# Altium project radxa_cm3i_io_board_v1.4.PrjPcb (part 2 of 4)

## Sheet 09.SchDoc
size 297 x 209 mm
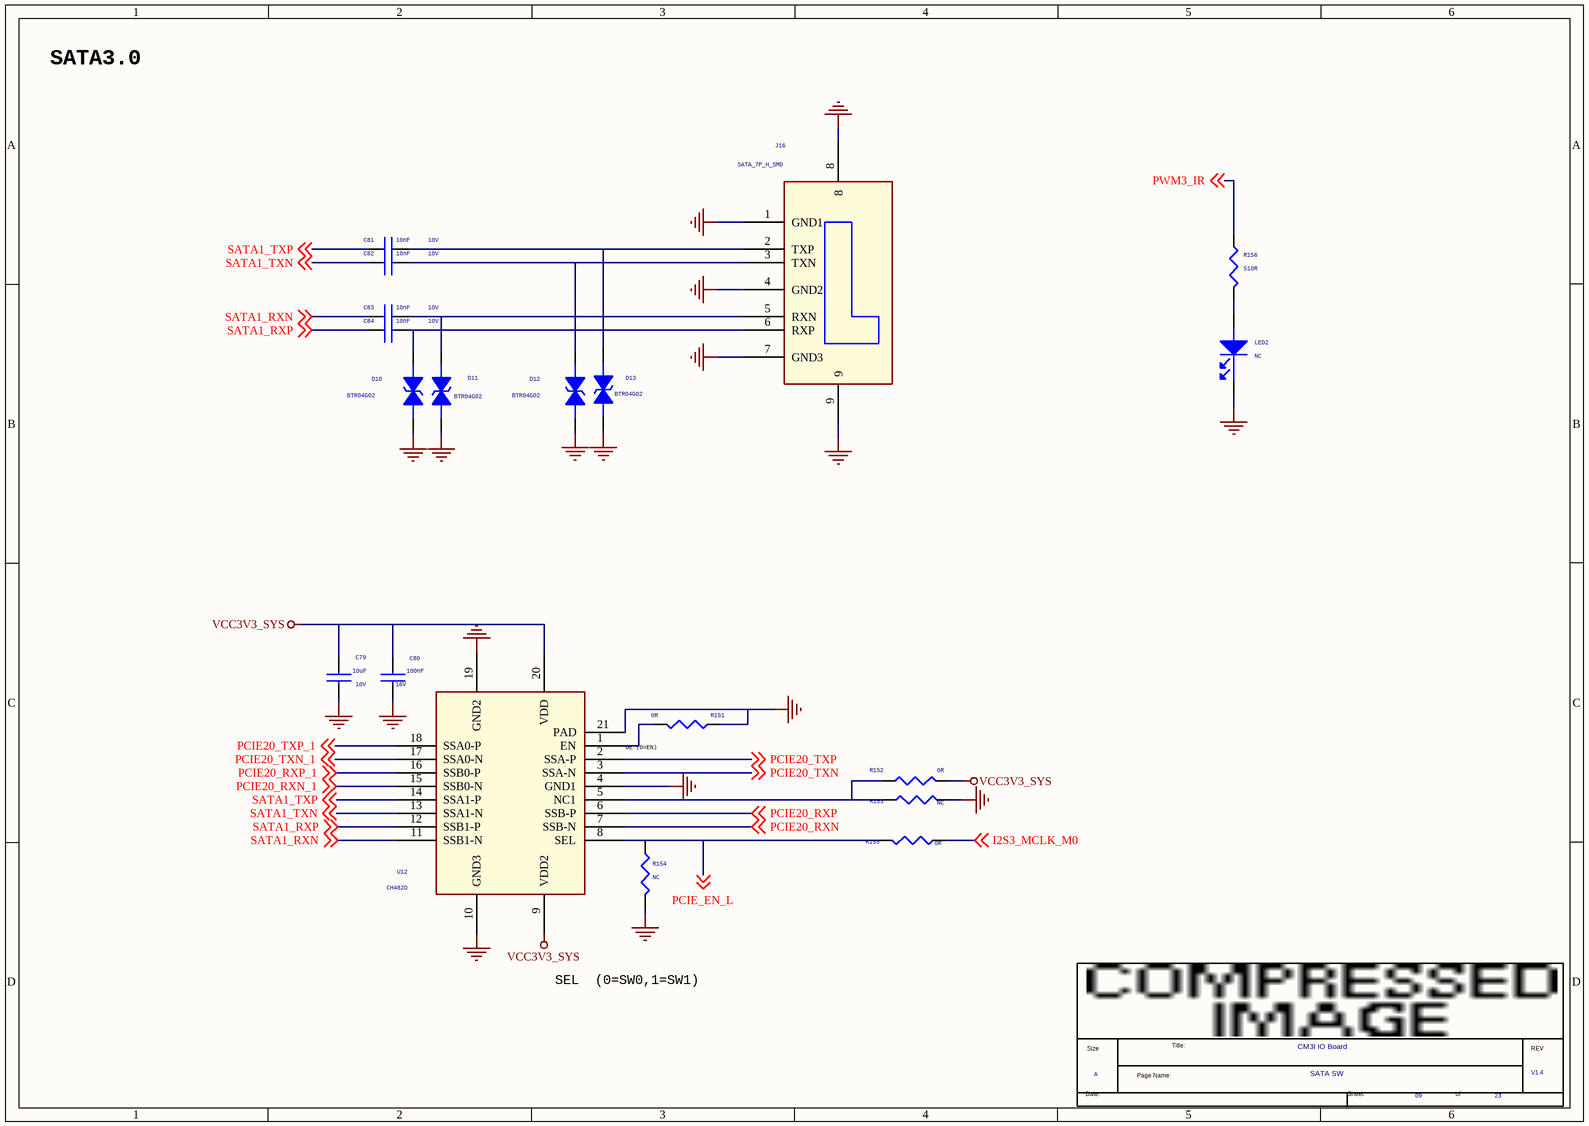
[diagram p7: 09.SchDoc]

### Parts
(Parts that share a designator on the sheet are numbered #1, #2 ... from top to bottom, then left to right.)
*#8  Page Count: 23  Page Number: 09  Page Size: A  Title: CM3I IO Board  RevCode: V1.4  Doc: SATA SW  (hidden comment: radxa_1010)  (graphical)
C79  10uF  Voltage: 10V  [C0603]
C80  100nF  Voltage: 16V  [C0402]
C81  10nF  Voltage: 10V  [C0402]
C82  10nF  Voltage: 10V  [C0402]
C83  10nF  Voltage: 10V  [C0402]
C84  10nF  Voltage: 10V  [C0402]
D10  BTR04G02  [ESD0402_1xD5]
D11  BTR04G02  [ESD0402_1xD5]
D12  BTR04G02  [ESD0402_1xD5]
D13  BTR04G02  [ESD0402_1xD5]
J16  SATA_7P_H_SMD  [SMD_SATA_7P_50_180]
LED2  NC  [LED0603]
R151  0R  [R0402]
R152  0R  [R0402]
R153  NC  [R0402]
R154  NC  [R0402]
R155  0R  [R0402]
R156  510R  [R0402]
U12  CH482D  [CH482X]

### Nets
GND: C79.2 C80.2 D10.1 D11.1 D12.1 D13.1 J16.1(GND1) J16.4(GND2) J16.7(GND3) J16.8 J16.9 LED2.2(CATHODE) R151.1 R153.1 R154.2 U12.4(GND1) U12.10(GND3) U12.19(GND2) U12.21(PAD)
VCC3V3_SYS: C79.1 C80.1 R152.1 U12.9(VDD2) U12.20(VDD)
I2S3_MCLK_M0: R155.2 ; off-sheet I2S3_MCLK_M0
PCIE20_RXN: U12.7(SSB-N) ; off-sheet PCIE20_RXN
PCIE20_RXN_1: U12.15(SSB0-N) ; off-sheet PCIE20_RXN_1
PCIE20_RXP: U12.6(SSB-P) ; off-sheet PCIE20_RXP
PCIE20_RXP_1: U12.16(SSB0-P) ; off-sheet PCIE20_RXP_1
PCIE20_TXN: U12.3(SSA-N) ; off-sheet PCIE20_TXN
PCIE20_TXN_1: U12.17(SSA0-N) ; off-sheet PCIE20_TXN_1
PCIE20_TXP: U12.2(SSA-P) ; off-sheet PCIE20_TXP
PCIE20_TXP_1: U12.18(SSA0-P) ; off-sheet PCIE20_TXP_1
PCIE_EN_L: R154.1 R155.1 U12.8(SEL) ; off-sheet PCIE_EN_L
PWM3_IR: R156.1 ; off-sheet PWM3_IR
SATA1_RXN: C83.1 U12.11(SSB1-N) ; off-sheet SATA1_RXN
SATA1_RXP: C84.1 U12.12(SSB1-P) ; off-sheet SATA1_RXP
SATA1_TXN: C82.1 U12.13(SSA1-N) ; off-sheet SATA1_TXN
SATA1_TXP: C81.1 U12.14(SSA1-P) ; off-sheet SATA1_TXP
NetC81_2: C81.2 D13.2 J16.2(TXP)
NetC82_2: C82.2 D12.2 J16.3(TXN)
NetC83_2: C83.2 D11.2 J16.5(RXN)
NetC84_2: C84.2 D10.2 J16.6(RXP)
NetLED2_1: LED2.1(ANODE) R156.2
NetR151_2: R151.2 U12.1(EN)
NetR152_2: R152.2 R153.2 U12.5(NC1)

### Notes on the sheet
- SATA3.0
- OE (0=EN)
- SEL  (0=SW0,1=SW1)
- (in symbol radxa_1010) Size; Title:; REV; Page Name:; Date:; Sheet; of

### Library data of the parts
C79 = CAP NP_0: cap,22.00uF,+/-10%,10V,X5R,C0805; Manufacturer: TDK; RK PN: C2012X5R1A226K125AB; Priority: A; Tolerance: 10%; Dielectric: X5R; Part Type: C0805; Manufacturer PN: C2012X5R1A226K125AB; Created by: JJJ
C80 = CAP NP_0: as C4 on sheet 04; Dielectric: X5R; Created by: JJJ; Part Type: C0402; RK PN: C1005X5R1C104K050BA
C81-C84 = CAP NP_0: cap,10.00nF,+/-10%,10V,X7R,C0201; Manufacturer PN: C0603X7R1A103K030BA; Manufacturer: TDK; Tolerance: 10%; Priority: A; Dielectric: X7R; Created by: JJJ; Part Type: C0201; RK PN: C0603X7R1A103K030BA
D10 = DIODE BI_DIR TRIG_0: as D6 on sheet 04; Created by: JJJ; Part Type: ESD_TVS; RK PN: ESD5451N
D11-D13 = DIODE BI_DIR TRIG_0: as D1 on sheet 04; Part Type: ESD_TVS; Manufacturer PN: ESD5451N; Created by: JJJ
J16 = SATA_DIP_1
LED2 = LED: 贴片LED灯，0603，红色; option: SATA2_ACT_LED; RK PN: LED_RED; Priority: A; Part Type: LED; Created by: JJJ
R151 R152 = RESISTOR_0_Dup1: as R9 on sheet 04; Created by: YTL; Part Type: 通用厚膜电阻; RK PN: RC0402JR-070RL
R153 = RESISTOR_0_Dup1: as R17 on sheet 04; Part Type: 通用厚膜电阻; Manufacturer PN: RC0402JR-070RL; Created by: YTL
R154 = RESISTOR_0_Dup1: 通用厚膜电阻,4K7,+/-5%,R0402,1/16W.; Manufacturer PN: RC0402JR-074K7L; Manufacturer: YAGEO; Tolerance: 5%; Wattage: 1/16W; Priority: A; Created by: YTL; Part Type: 通用厚膜电阻; RK PN: RC0402JR-074K7L
R155 = RESISTOR_0_Dup1: 通用厚膜电阻,100R,+/-5%,R0402,1/16W.; Manufacturer PN: RC0402JR-07100RL; Manufacturer: YAGEO; Tolerance: 5%; Wattage: 1/16W; Priority: A; Created by: YTL; Part Type: 通用厚膜电阻; RK PN: RC0402JR-07100RL
R156 = RESISTOR_0_Dup1: 通用厚膜电阻,510R,+/-5%,R0402,1/16W.; Manufacturer PN: RC0402JR-07510RL; Manufacturer: YAGEO; Tolerance: 5%; Wattage: 1/16W; Priority: A; Created by: YTL; Part Type: 通用厚膜电阻; RK PN: RC0402JR-07510RL
U12 = CH482X
*#8 = radxa_1010: Page Create Date: March  8, 1995

## Sheet 10.SchDoc
size 297 x 209 mm
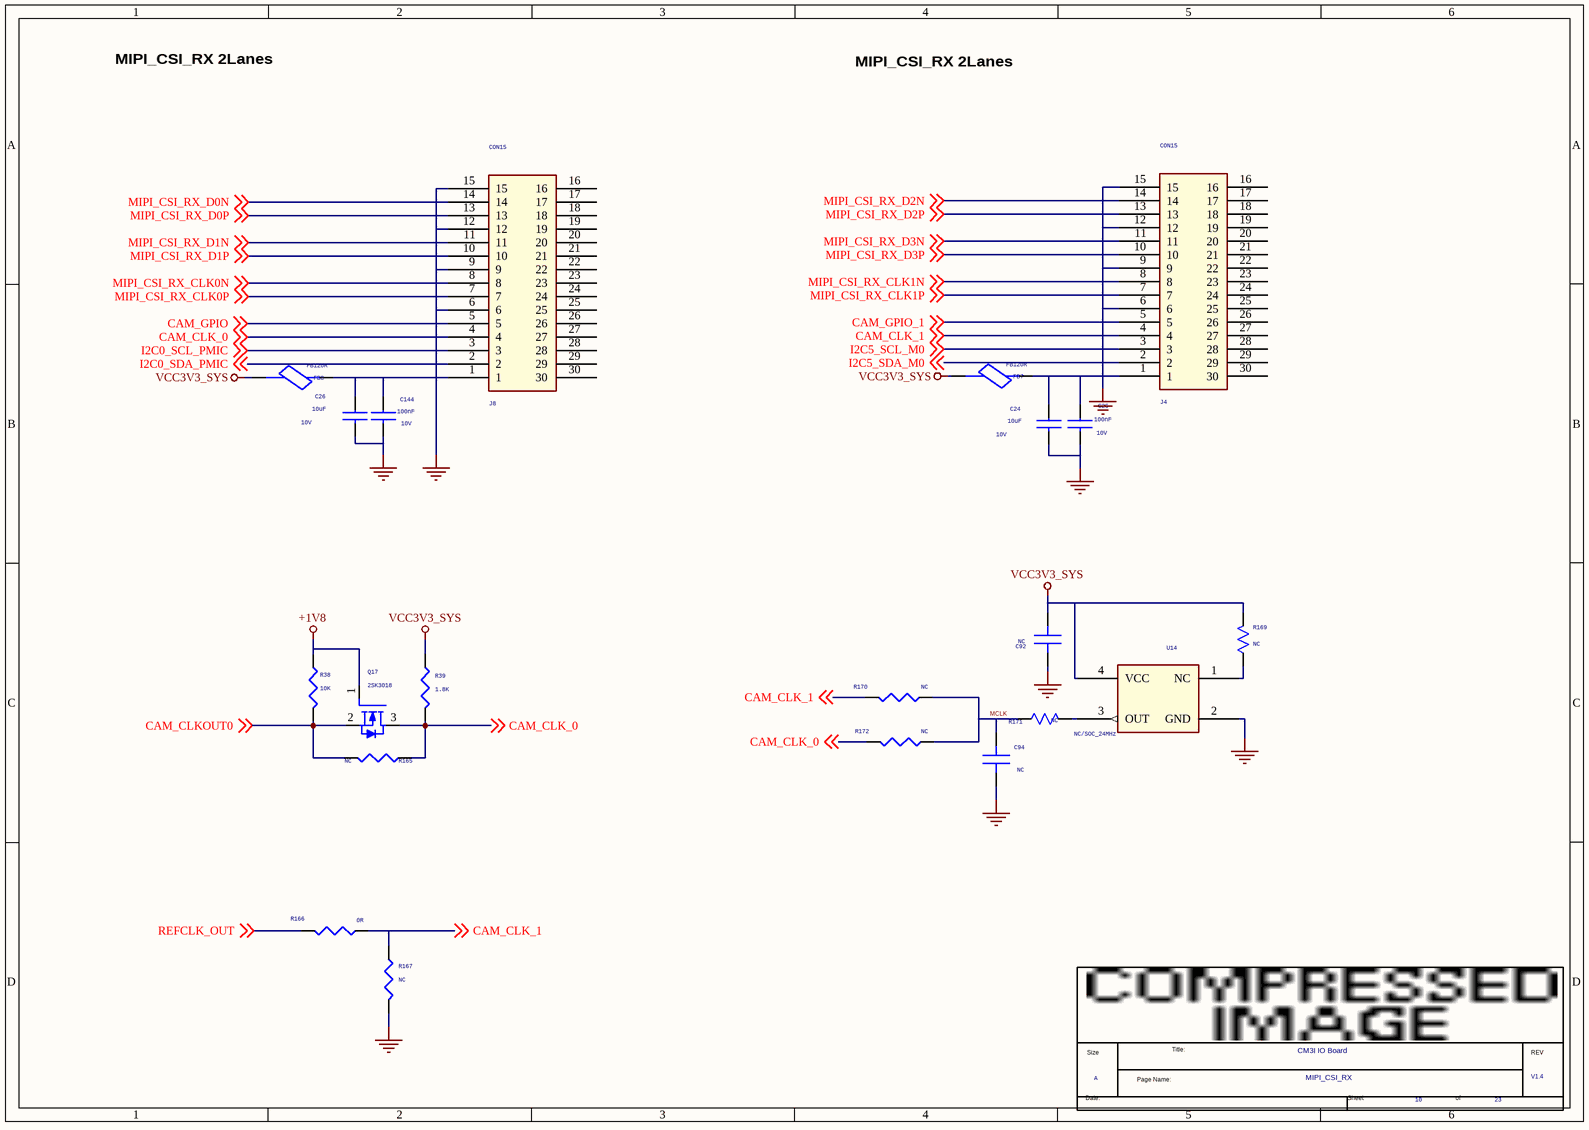
[diagram p8: 10.SchDoc]

### Parts
(Parts that share a designator on the sheet are numbered #1, #2 ... from top to bottom, then left to right.)
*#9  Page Count: 23  Page Number: 10  Page Size: A  Title: CM3I IO Board  RevCode: V1.4  Doc: MIPI_CSI_RX  (hidden comment: radxa_1010)  (graphical)
C24  10uF  Voltage: 10V  [C0603]
C25  100nF  Voltage: 10V  [C0402]
C26  10uF  Voltage: 10V  [C0603]
C92  NC  [C0402]
C94  NC  [C0402]
C144  100nF  Voltage: 10V  [C0402]
FB7  FB120R  [R0402]
FB8  FB120R  [R0402]
J4  CON15  [FPC15PIN-1.0MM-LS]
J8  CON15  [FPC15PIN-1.0MM-LS]
Q17  2SK3018  [SOT23]
R38  10K  [R0402]
R39  1.8K  [R0402]
R165  NC  [R0402]
R166  0R  [R0402]
R167  NC  [R0402]
R169  NC  [R0402]
R170  NC  [R0402]
R171  NC  [R0402]
R172  NC  [R0402]
U14  NC/SOC_24MHz  [CRY4_3R20X2R50X0R80]

### Nets
+1V8: Q17.1(GATE) R38.1
GND: C24.2 C25.2 C26.2 C92.2 C94.2 C144.2 J4.6 J4.9 J4.12 J4.15 J8.6 J8.9 J8.12 J8.15 R167.2 U14.2(GND)
VCC3V3_SYS: C92.1 FB7.1 FB8.1 R39.1 R169.2 U14.4(VCC)
CAM_CLK_0: J8.4 Q17.3(DRAIN) R39.2 R165.1 R172.2 ; off-sheet CAM_CLK_0
CAM_CLK_1: J4.4 R166.2 R167.1 R170.2 ; off-sheet CAM_CLK_1
CAM_CLKOUT0: Q17.2(SOURCE) R38.2 R165.2 ; off-sheet CAM_CLKOUT0
CAM_GPIO: J8.5 ; off-sheet CAM_GPIO
CAM_GPIO_1: J4.5 ; off-sheet CAM_GPIO_1
I2C0_SCL_PMIC: J8.3 ; off-sheet I2C0_SCL_PMIC
I2C0_SDA_PMIC: J8.2 ; off-sheet I2C0_SDA_PMIC
I2C5_SCL_M0: J4.3 ; off-sheet I2C5_SCL_M0
I2C5_SDA_M0: J4.2 ; off-sheet I2C5_SDA_M0
MCLK: C94.1 R170.1 R171.2 R172.1
MIPI_CSI_RX_CLK0N: J8.8 ; off-sheet MIPI_CSI_RX_CLK0N
MIPI_CSI_RX_CLK0P: J8.7 ; off-sheet MIPI_CSI_RX_CLK0P
MIPI_CSI_RX_CLK1N: J4.8 ; off-sheet MIPI_CSI_RX_CLK1N
MIPI_CSI_RX_CLK1P: J4.7 ; off-sheet MIPI_CSI_RX_CLK1P
MIPI_CSI_RX_D0N: J8.14 ; off-sheet MIPI_CSI_RX_D0N
MIPI_CSI_RX_D0P: J8.13 ; off-sheet MIPI_CSI_RX_D0P
MIPI_CSI_RX_D1N: J8.11 ; off-sheet MIPI_CSI_RX_D1N
MIPI_CSI_RX_D1P: J8.10 ; off-sheet MIPI_CSI_RX_D1P
MIPI_CSI_RX_D2N: J4.14 ; off-sheet MIPI_CSI_RX_D2N
MIPI_CSI_RX_D2P: J4.13 ; off-sheet MIPI_CSI_RX_D2P
MIPI_CSI_RX_D3N: J4.11 ; off-sheet MIPI_CSI_RX_D3N
MIPI_CSI_RX_D3P: J4.10 ; off-sheet MIPI_CSI_RX_D3P
REFCLK_OUT: R166.1 ; off-sheet REFCLK_OUT
NetC24_1: C24.1 C25.1 FB7.2 J4.1
NetC26_1: C26.1 C144.1 FB8.2 J8.1
NetR169_1: R169.1 U14.1(NC)
NetR171_1: R171.1 U14.3(OUT)

Not connected (* = marked no-connect by the designer): J4 16 17 18 19 20 21 22 23 24 25 26 27 28 29 30; J8 16 17 18 19 20 21 22 23 24 25 26 27 28 29 30

### Notes on the sheet
- MIPI_CSI_RX 2Lanes
- (in symbol radxa_1010) Title:; Size; REV; Page Name:; Date:; Sheet; of

### Library data of the parts
C24 C26 = CAP NP_0: cap,10.00uF,+/-10%,10V,X5R,C0603; Manufacturer: TDK; RK PN: C1608X5R1A106K080AC; Priority: A; Tolerance: 10%; Dielectric: X5R; Part Type: C0603; Manufacturer PN: C1608X5R1A106K080AC; Created by: JJJ
C25 = CAP NP_0: as C12 on sheet 04; Dielectric: X5R; Created by: JJJ; Part Type: C0402; RK PN: C1005X5R1A104K050BA
C92 = C: 贴片陶瓷电容 0402 X5R 1uF±10% 16V; PARTS: 1; Part Number: 823030105005; OriginalSymbolOrigin: (0,30); PKG_TYPE: CAP2-100-250; LEVEL: STD; PINSWAP: (A,B); ROOM: DVDD_MEDIA; Grade: B; Approved: 已承认; Part Type: 电容
C94 = C: 贴片陶瓷电容 0402 NPO 10pF±5% 50V; PARTS: 1; Part Number: 823060100001; OriginalSymbolOrigin: (0,30); PKG_TYPE: CAP2-100-250; LEVEL: STD; PINSWAP: (A,B); Approved: 已承认; Grade: B; ROOM: AN41908; Part Type: 电容
C144 = CAP NP_0: cap,100.00nF,+/-10%,10V,X5R,C0402; Manufacturer: TDK; RK PN: C1005X5R1A104K050BA; Priority: A; Tolerance: 10%; Dielectric: X5R; Part Type: C0402; Manufacturer PN: C1005X5R1A104K050BA; Created by: JJJ
FB7 FB8 = FB: 贴片磁珠 0603 600Ω±25% 1000mA 铁氧体叠片 UPZ1608E601-1R0T 顺络; Part Number: 832026000003; Grade: D; Approved: 已承认; Part Type: 磁珠
J4 J8 = CON15_5
Q17 = MOSFET N: NMOS,2SK3018,SOT_323,Id=0.1A,Vds=30V; Manufacturer: ROHM; Rds: 5ohm; Priority: A; Id_max: 0.1A; Vgs: 20V; VDS: 30V; Vgsth: 1.5V; Pd: 0.2W; RK PN: 2SK3018; Part Type: NMOS; Manufacturer PN: 2SK3018; Created by: JJJ
R38 = RESISTOR_0_Dup4: 通用厚膜电阻,10K,+/-5%,R0402,1/16W.; Manufacturer: YAGEO; Tolerance: 5%; RK PN: RC0402JR-0710KL; Priority: A; Wattage: 1/16W; Part Type: 通用厚膜电阻; Manufacturer PN: RC0402JR-0710KL; Created by: YTL
R39 = RESISTOR_0_Dup4: 通用厚膜电阻,1K8,+/-5%,R0402,1/16W.; Manufacturer: YAGEO; Tolerance: 5%; RK PN: RC0402JR-071K8L; Priority: A; Wattage: 1/16W; Part Type: 通用厚膜电阻; Manufacturer PN: RC0402JR-071K8L; Created by: YTL
R165 R166 R170 R172 = RESISTOR_0_Dup1: 通用厚膜电阻,100R,+/-5%,R0402,1/16W.; Manufacturer: YAGEO; Tolerance: 5%; RK PN: RC0402JR-07100RL; Priority: A; Wattage: 1/16W; Part Type: 通用厚膜电阻; Manufacturer PN: RC0402JR-07100RL; Created by: YTL
R167 = RESISTOR_0_Dup1: 通用厚膜电阻,120R,+/-5%,R0402,1/16W.; Manufacturer PN: RC0402JR-07120RL; Manufacturer: YAGEO; Tolerance: 5%; Wattage: 1/16W; Priority: A; Created by: YTL; Part Type: 通用厚膜电阻; RK PN: RC0402JR-07120RL
R169 = R: 贴片电阻 0805 0Ω±5%; PARTS: 1; Part Number: 811040000001; LEVEL: STD; PKG_TYPE: 2; PINSWAP: (A,B); OriginalSymbolOrigin: (10,20); ROOM: DC-IRIS; Grade: B; Approved: 已承认; Part Type: 电阻
R171 = R: 贴片电阻 0402 33Ω±5%; PARTS: 1; Part Number: 811020330001; LEVEL: STD; PKG_TYPE: 2; PINSWAP: (A,B); OriginalSymbolOrigin: (10,20); Approved: 已承认; Grade: B; ROOM: AN41908; Part Type: 电阻
U14 = OSC_4PIN_1: 贴片钟振 27.000MHz ±30PPM  3.3V 3.2x2.5mm; Part Number: 841042700403; Grade: B; Approved: 已承认; ROOM: AN41908; Part Type: 钟振
*#9 = radxa_1010: Page Create Date: March  8, 1995

## Sheet 11.SchDoc
size 420 x 297 mm
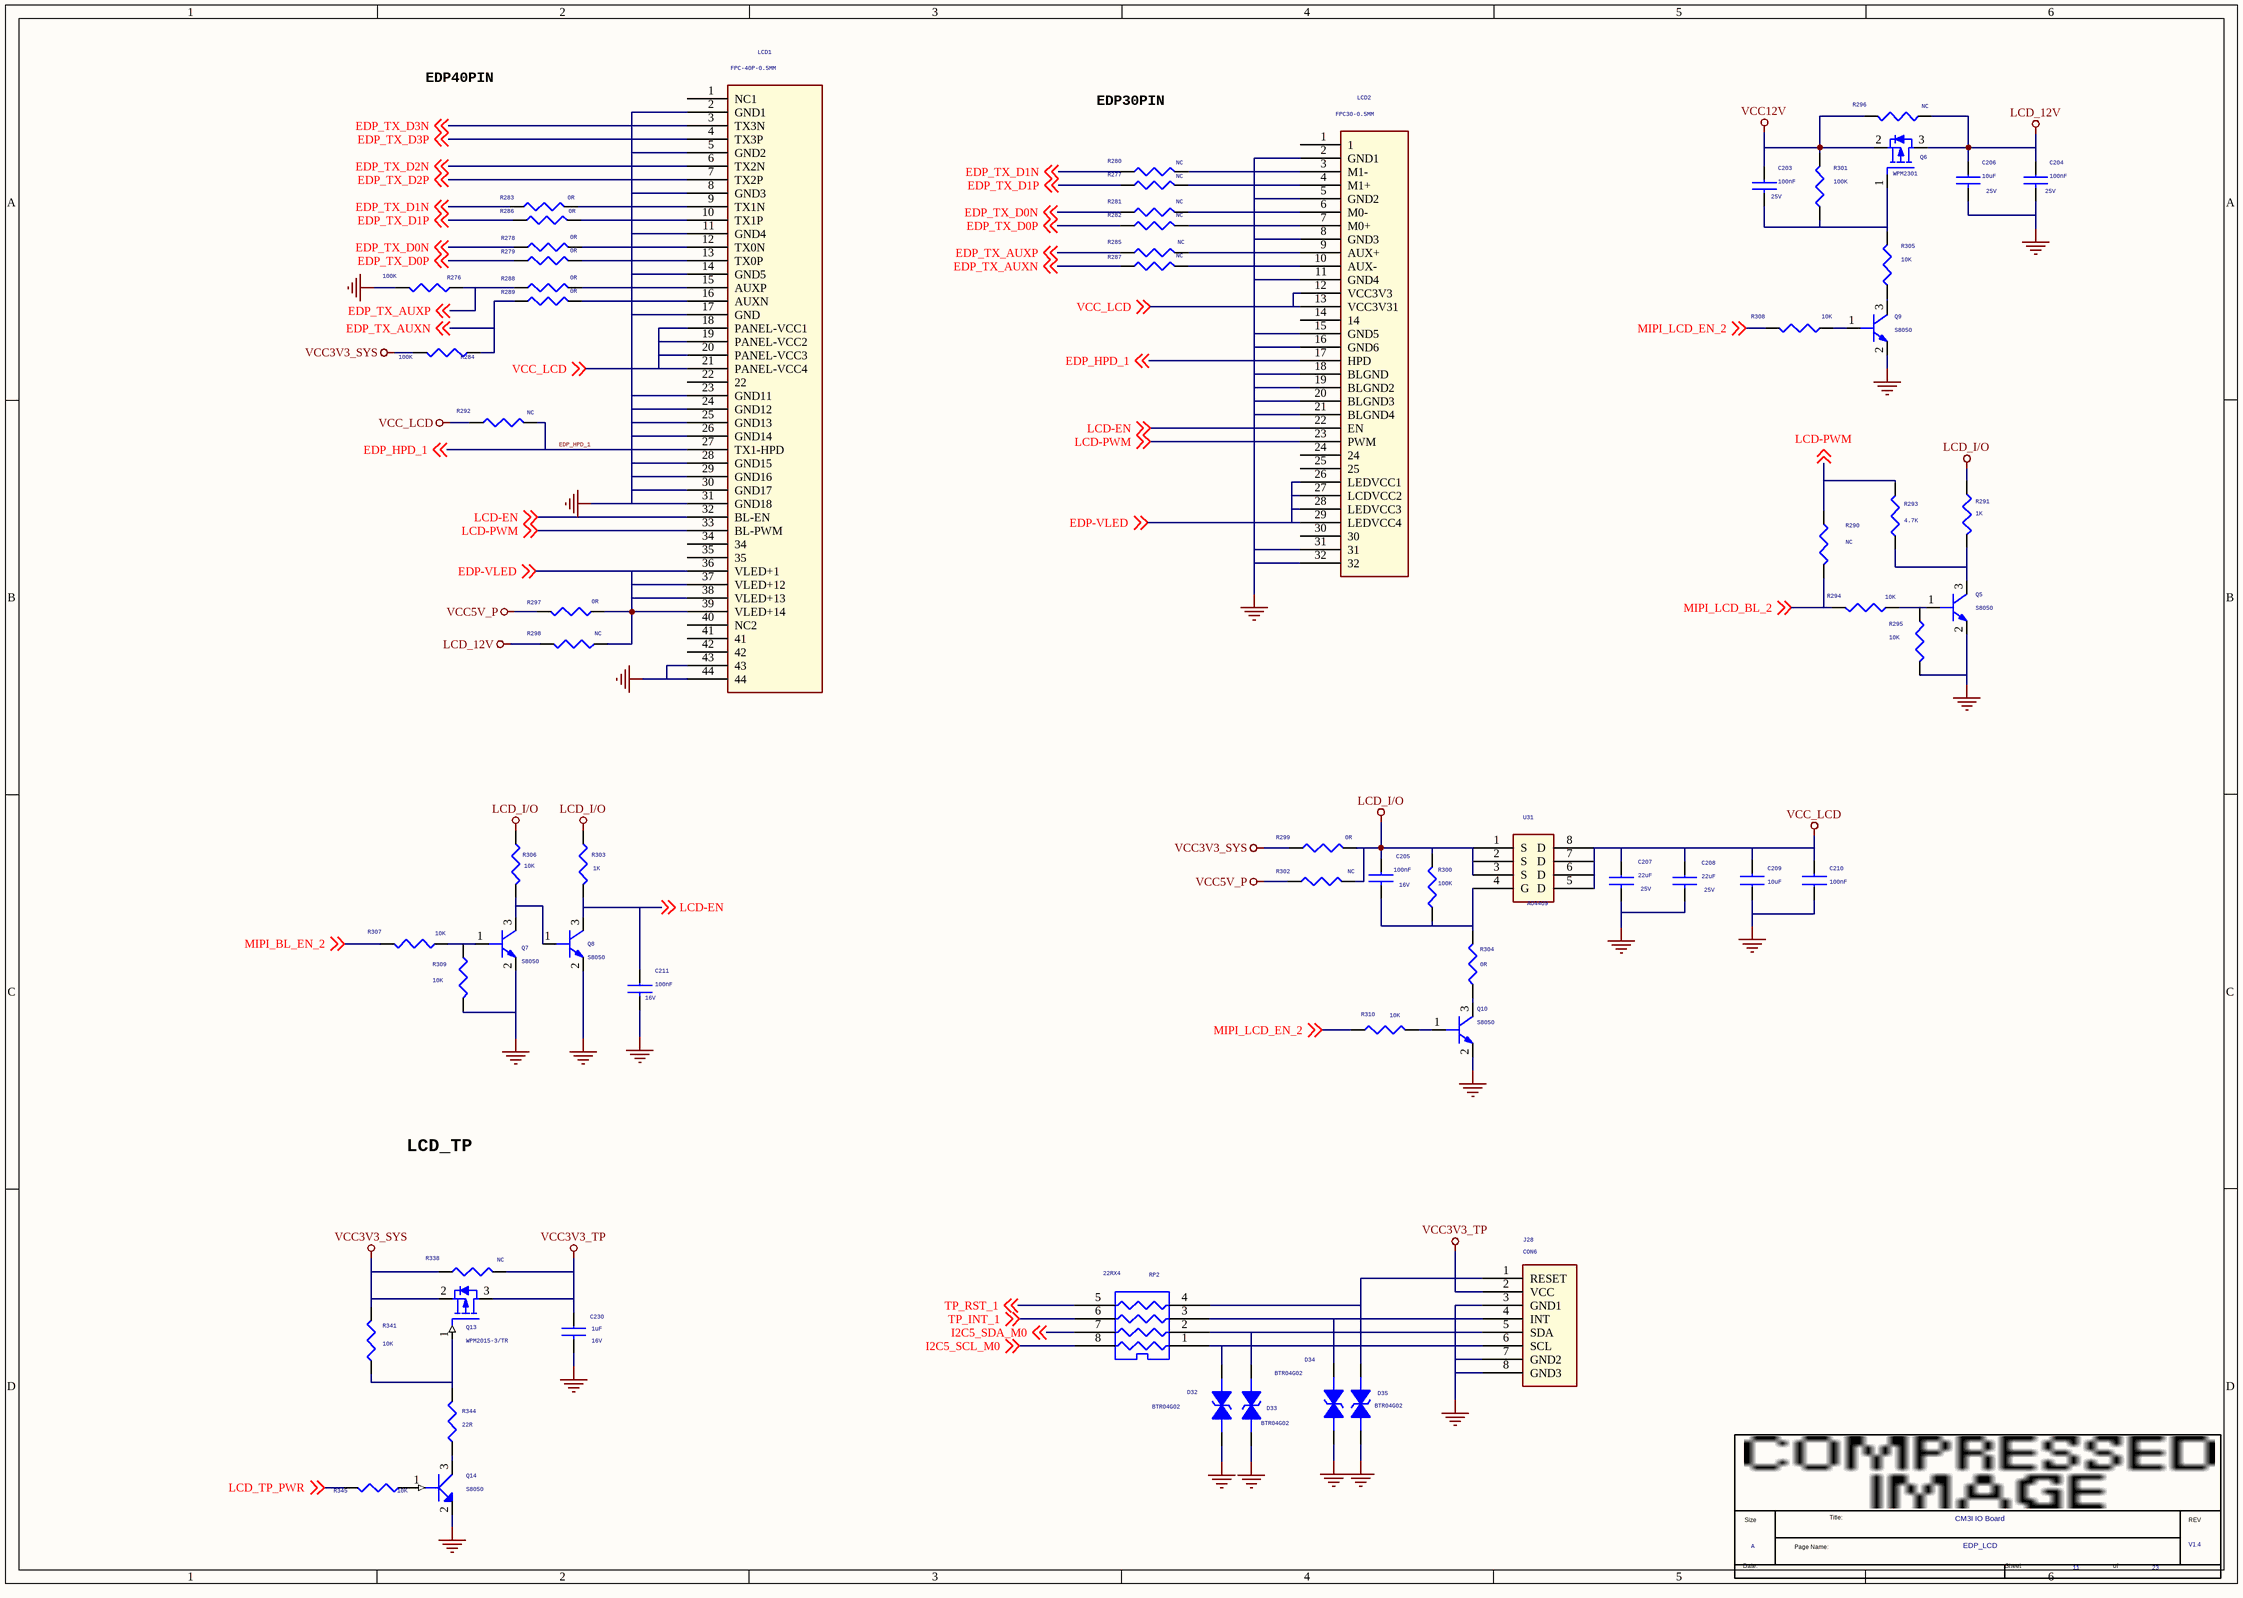
[diagram p9: 11.SchDoc]

### Parts
(Parts that share a designator on the sheet are numbered #1, #2 ... from top to bottom, then left to right.)
*#10  Page Count: 23  Page Number: 11  Page Size: A  Title: CM3I IO Board  RevCode: V1.4  Doc: EDP_LCD  (hidden comment: radxa_1010)  (graphical)
C203  100nF  Voltage: 25V  [C0402]
C204  100nF  Voltage: 25V  [C0402]
C205  100nF  Voltage: 16V  [C0402]
C206  10uF  Voltage: 25V  [C0805]
C207  22uF  Voltage: 25V  [C0603]
C208  22uF  Voltage: 25V  [C0603]
C209  10uF  [C0603]
C210  100nF  [C0603]
C211  100nF  Voltage: 16V  [C0402]
C230  1uF  Voltage: 16V  [C0402]
D32  BTR04G02  [ESD0402_1xD5]
D33  BTR04G02  [ESD0402_1xD5]
D34  BTR04G02  [ESD0402_1xD5]
D35  BTR04G02  [ESD0402_1xD5]
J28  CON6  [FPC6-0.5MM-2660H]
LCD1  FPC-40P-0.5MM  [EDP_1]
LCD2  FPC30-0.5MM  [EDP30PIN]
Q5  S8050  [SOT_23]
Q6  WPM2301  [SOT23]
Q7  S8050  [SOT_23]
Q8  S8050  [SOT_23]
Q9  S8050  [SOT23]
Q10  S8050  [SOT23]
Q13  WPM2015-3/TR  [SOT23]
Q14  S8050  [SOT23]
R276  100K  [R0402]
R277  NC  [R0402]
R278  0R  [R0402]
R279  0R  [R0402]
R280  NC  [R0402]
R281  NC  [R0402]
R282  NC  [R0402]
R283  0R  [R0402]
R284  100K  [R0402]
R285  NC  [R0402]
R286  0R  [R0402]
R287  NC  [R0402]
R288  0R  [R0402]
R289  0R  [R0402]
R290  NC  [R0402]
R291  1K  [R0402]
R292  NC  [R0402]
R293  4.7K  [R0402]
R294  10K  [R0402]
R295  10K  [R0402]
R296  NC  [R0402]
R297  0R  [R0603]
R298  NC  [R0603]
R299  0R  [R0402]
R300  100K  [R0402]
R301  100K  [R0402]
R302  NC  [R0402]
R303  1K  [R0402]
R304  0R  [R0402]
R305  10K  [R0402]
R306  10K  [R0402]
R307  10K  [R0402]
R308  10K  [R0402]
R309  10K  [R0402]
R310  10K  [R0402]
R338  NC  [R0402]
R341  10K  [R0402]
R344  22R  [R0402]
R345  10K  [R0402]
RP2  22RX4  [RN8P4RC]
U31  AO4409  [SOP8-50-150]

### Nets
GND: C204.2 C206.2 C207.2 C208.2 C209.2 C210.2 C211.2 C230.2 D32.1 D33.1 D34.1 D35.1 J28.3(GND1) J28.7(GND2) J28.8(GND3) LCD1.2(GND1) LCD1.5(GND2) LCD1.8(GND3) LCD1.11(GND4) LCD1.14(GND5) LCD1.17(GND) LCD1.23(GND11) LCD1.24(GND12) LCD1.25(GND13) LCD1.26(GND14) LCD1.28(GND15) LCD1.29(GND16) LCD1.30(GND17) LCD1.31(GND18) LCD1.43 LCD1.44 LCD2.2(GND1) LCD2.5(GND2) LCD2.8(GND3) LCD2.11(GND4) LCD2.15(GND5) LCD2.16(GND6) LCD2.18(BLGND) LCD2.19(BLGND2) LCD2.20(BLGND3) LCD2.21(BLGND4) LCD2.31 LCD2.32 Q5.2(EMITTER) Q7.2(EMITTER) Q8.2(EMITTER) Q9.2(EMITTER) Q10.2(EMITTER) Q14.2(E) R276.2 R295.1 R309.1
LCD_12V: C204.1 C206.1 Q6.3(DRAIN) R296.2 R298.1
LCD_I/O: C205.1 R291.2 R299.2 R300.1 R302.2 R303.2 R306.2 U31.1(S) U31.2(S) U31.3(S)
VCC3V3_SYS: Q13.2(SOURCE) R284.2 R299.1 R338.1 R341.2
VCC3V3_TP: C230.1 J28.2(VCC) Q13.3(DRAIN) R338.2
VCC5V_P: R297.1 R302.1
VCC12V: C203.1 Q6.2(SOURCE) R296.1 R301.1
VCC_LCD: C207.1 C208.1 C209.1 C210.1 LCD1.18(PANEL-VCC1) LCD1.19(PANEL-VCC2) LCD1.20(PANEL-VCC3) LCD1.21(PANEL-VCC4) LCD2.12(VCC3V3) LCD2.13(VCC3V31) R292.1 U31.5(D) U31.6(D) U31.7(D) U31.8(D) ; off-sheet VCC_LCD
EDP-VLED: LCD1.36(VLED+1) LCD1.37(VLED+12) LCD1.38(VLED+13) LCD1.39(VLED+14) LCD2.26(LEDVCC1) LCD2.27(LCDVCC2) LCD2.28(LEDVCC3) LCD2.29(LEDVCC4) R297.2 R298.2 ; off-sheet EDP-VLED
EDP_HPD_1: LCD1.27(TX1-HPD) LCD2.17(HPD) R292.2 ; off-sheet EDP_HPD_1
EDP_TX_AUXN: R284.1 R287.2 R289.2 ; off-sheet EDP_TX_AUXN
EDP_TX_AUXP: R276.1 R285.2 R288.2 ; off-sheet EDP_TX_AUXP
EDP_TX_D0N: R278.2 R281.2 ; off-sheet EDP_TX_D0N
EDP_TX_D0P: R279.2 R282.2 ; off-sheet EDP_TX_D0P
EDP_TX_D1N: R280.2 R283.2 ; off-sheet EDP_TX_D1N
EDP_TX_D1P: R277.2 R286.2 ; off-sheet EDP_TX_D1P
EDP_TX_D2N: LCD1.6(TX2N) ; off-sheet EDP_TX_D2N
EDP_TX_D2P: LCD1.7(TX2P) ; off-sheet EDP_TX_D2P
EDP_TX_D3N: LCD1.3(TX3N) ; off-sheet EDP_TX_D3N
EDP_TX_D3P: LCD1.4(TX3P) ; off-sheet EDP_TX_D3P
I2C5_SCL_M0: RP2.8(R1) ; off-sheet I2C5_SCL_M0
I2C5_SDA_M0: RP2.7(R2) ; off-sheet I2C5_SDA_M0
LCD-EN: C211.1 LCD1.32(BL-EN) LCD2.22(EN) Q8.3(COLLECTOR) R303.1 ; off-sheet LCD-EN
LCD-PWM: LCD1.33(BL-PWM) LCD2.23(PWM) R290.2 R293.1 ; off-sheet LCD-PWM
LCD_TP_PWR: R345.2 ; off-sheet LCD_TP_PWR
MIPI_BL_EN_2: R307.1 ; off-sheet MIPI_BL_EN_2
MIPI_LCD_BL_2: R290.1 R294.1 ; off-sheet MIPI_LCD_BL_2
MIPI_LCD_EN_2: R308.1 R310.1 ; off-sheet MIPI_LCD_EN_2
TP_INT_1: RP2.6(R3) ; off-sheet TP_INT_1
TP_RST_1: RP2.5(R4) ; off-sheet TP_RST_1
NetC203_2: C203.2 Q6.1(GATE) R301.2 R305.1
NetC205_2: C205.2 R300.2 R304.1 U31.4(G)
NetD32_2: D32.2 J28.6(SCL) RP2.1(R1)
NetD33_2: D33.2 J28.5(SDA) RP2.2(R2)
NetD34_2: D34.2 J28.4(INT) RP2.3(R3)
NetD35_2: D35.2 J28.1(RESET) RP2.4(R4)
NetLCD1_9: LCD1.9(TX1N) R283.1
NetLCD1_10: LCD1.10(TX1P) R286.1
NetLCD1_12: LCD1.12(TX0N) R278.1
NetLCD1_13: LCD1.13(TX0P) R279.1
NetLCD1_15: LCD1.15(AUXP) R288.1
NetLCD1_16: LCD1.16(AUXN) R289.1
NetLCD2_3: LCD2.3(M1-) R280.1
NetLCD2_4: LCD2.4(M1+) R277.1
NetLCD2_6: LCD2.6(M0-) R281.1
NetLCD2_7: LCD2.7(M0+) R282.1
NetLCD2_9: LCD2.9(AUX+) R285.1
NetLCD2_10: LCD2.10(AUX-) R287.1
NetQ5_1: Q5.1(BASE) R294.2 R295.2
NetQ5_3: Q5.3(COLLECTOR) R291.1 R293.2
NetQ7_1: Q7.1(BASE) R307.2 R309.2
NetQ7_3: Q7.3(COLLECTOR) Q8.1(BASE) R306.1
NetQ9_1: Q9.1(BASE) R308.2
NetQ9_3: Q9.3(COLLECTOR) R305.2
NetQ10_1: Q10.1(BASE) R310.2
NetQ10_3: Q10.3(COLLECTOR) R304.2
NetQ13_1: Q13.1(GATE) R341.1 R344.2
NetQ14_1: Q14.1(B) R345.1
NetQ14_3: Q14.3(C) R344.1

Not connected (* = marked no-connect by the designer): LCD1 1(NC1) 22 34 35 40(NC2) 41 42; LCD2 1 14 24 25 30

### Notes on the sheet
- EDP40PIN
- EDP30PIN
- LCD_TP
- (in symbol radxa_1010) Size; Title:; REV; Page Name:; Date:; Sheet; of

### Library data of the parts
C203 C204 = CAP NP_0: cap,100.00nF,+/-10%,16V,X5R,C0402; Manufacturer: TDK; RK PN: C1005X5R1C104K050BA; Priority: A; Tolerance: 10%; Dielectric: X5R; Part Type: C0402; Manufacturer PN: C1005X5R1C104K050BA; Created by: JJJ
C205 C211 C230 = CAP NP_0: cap,100.00nF,+/-10%,6.3V,X5R,C0402; Manufacturer: TDK; RK PN: C1005X5R0J104K050BA; Priority: A; Tolerance: 10%; Dielectric: X5R; Part Type: C0402; Manufacturer PN: C1005X5R0J104K050BA; Created by: JJJ
C206 = CAP NP_0: cap,10.00uF,+/-10%,6.3V,X5R,C0603; Manufacturer: TDK; RK PN: C1608X5R0J106K080AB; Priority: A; Tolerance: 10%; Dielectric: X5R; Part Type: C0603; Manufacturer PN: C1608X5R0J106K080AB; Created by: JJJ
C207 = CAP NP_0: cap,4.70uF,+/-10%,6.3V,X5R,C0603; Manufacturer: TDK; RK PN: C1608X5R0J475K080AB; Priority: A; Tolerance: 10%; Dielectric: X5R; Part Type: C0603; Manufacturer PN: C1608X5R0J475K080AB; Created by: JJJ
C208 = CAP NP_0: cap,4.70uF,+/-10%,6.3V,X5R,C0603; Manufacturer PN: C1608X5R0J475K080AB; Manufacturer: TDK; Tolerance: 10%; Priority: A; Dielectric: X5R; Created by: JJJ; Part Type: C0603; RK PN: C1608X5R0J475K080AB
C209 = CAP NP_Dup2: CAP,MLCC,4.7uF,+/-10%,X5R,6.3V,SMD0603
C210 = CAP NP_Dup2: CAP,MLCC,100nF,+/-10%,X7R,6.3V,SMD0402
D32 D34 D35 = DIODE BI_DIR TRIG_0: 1-Line, Bi-directional, Transient Voltage Suppressors.17.5pF.; Manufacturer PN: ESD5451N; Manufacturer: WillSemi(韦尔半导体); OPTION: DNP; Priority: A; Created by: JJJ; Part Type: ESD_TVS; RK PN: ESD5451N
D33 = DIODE BI_DIR TRIG_0: 1-Line, Bi-directional, Transient Voltage Suppressors.17.5pF.; Manufacturer: WillSemi(韦尔半导体); RK PN: ESD5451N; Priority: A; OPTION: DNP; Part Type: ESD_TVS; Manufacturer PN: ESD5451N; Created by: JJJ
J28 = CON6_1
LCD1 = EDP_0
LCD2 = EDP30PIN
Q5 Q8 Q10 = NPN: S8050 SOT23; Manufacturer: 长电; Manufacturer PN: S8050_SOT23; Priority: A; Ic: 0.5A; Vceo: 25V; Pc: 0.3W; RK PN: S8050; Part Type: NPN; Created by: JJJ
Q6 = MOSFET P_Dup1: PMOS,WPM3407-3/TR,SOT_23,Id=4.4A,Vds=30V; Manufacturer: WillSemi(韦尔半导体); Pd: 0.9W; Vgsth: 2.0V; VDS: 30V; Vgs: ±20V; Id_max: 4.4A; Priority: A; Created by: JJJ; Manufacturer PN: WPM3407-3/TR; Part Type: PMOS; RK PN: WPM3407-3/TR
Q7 = NPN: S8050 SOT23; Manufacturer PN: S8050_SOT23; Manufacturer: 长电; Pc: 0.3W; Vceo: 25V; Ic: 0.5A; Priority: A; Created by: JJJ; Part Type: NPN; RK PN: S8050
Q9 = NPN: S8050,SOT23; Manufacturer PN: S8050_SOT23; Manufacturer: 长电; Pc: 0.3W; Vceo: 25V; Ic: 0.5A; Priority: A; Created by: JJJ; Part Type: NPN; RK PN: S8050
Q13 = MOSFET P: PMOS,WPM2015-3/TR,SOT_23,Id=2.4A,Vds=20V; Manufacturer: WillSemi(韦尔半导体); ROOM: CHG; Priority: A; Id_max: 2.4A; Vgs: ±8V; VDS: 20V; Vgsth: 0.62V; Pd: 0.5W; option: DNP; RK PN: WPM2015-3/TR; Part Type: PMOS; Manufacturer PN: WPM2015-3/TR; Created by: JJJ
Q14 = NPN4
R276 R284 = RESISTOR_1
R277-R279 R282 R283 R285 R288 R289 = RESISTOR_0_Dup1: 通用厚膜电阻,22R,+/-5%,R0402,1/16W.; Manufacturer PN: RC0402JR-0722RL; Manufacturer: YAGEO; Tolerance: 5%; Wattage: 1/16W; Priority: A; Created by: YTL; Part Type: 通用厚膜电阻; RK PN: RC0402JR-0722RL
R280 R281 R286 R287 = RESISTOR_0_Dup1: 通用厚膜电阻,22R,+/-5%,R0402,1/16W.; Manufacturer: YAGEO; Tolerance: 5%; RK PN: RC0402JR-0722RL; Priority: A; Wattage: 1/16W; Part Type: 通用厚膜电阻; Manufacturer PN: RC0402JR-0722RL; Created by: YTL
R290 R293 R296 R299 R303 R306 R308 R341 = RESISTOR_0_Dup1: 通用厚膜电阻,10K,+/-5%,R0402,1/16W.; Manufacturer: YAGEO; Tolerance: 5%; RK PN: RC0402JR-0710KL; Priority: A; Wattage: 1/16W; Part Type: 通用厚膜电阻; Manufacturer PN: RC0402JR-0710KL; Created by: YTL
R291 R294 R295 R302 R304 R305 R307 R309 R310 = RESISTOR_0_Dup1: 通用厚膜电阻,10K,+/-5%,R0402,1/16W.; Manufacturer PN: RC0402JR-0710KL; Manufacturer: YAGEO; Tolerance: 5%; Wattage: 1/16W; Priority: A; Created by: YTL; Part Type: 通用厚膜电阻; RK PN: RC0402JR-0710KL
R292 = RES 1B: ROHS CHIP RES 4.7K 1/16W 5%
R297 R298 = RES 1B: ROHS CHIP RES 4.7R 1/4W 5%
R300 = RESISTOR_0_Dup1: 通用厚膜电阻,100K,+/-5%,R0402,1/16W.; Manufacturer PN: RC0402JR-07100KL; Manufacturer: YAGEO; Tolerance: 5%; Wattage: 1/16W; Priority: A; Created by: YTL; Part Type: 通用厚膜电阻; RK PN: RC0402JR-07100KL
R301 R345 = RESISTOR_0_Dup1: 通用厚膜电阻,100K,+/-5%,R0402,1/16W.; Manufacturer: YAGEO; Tolerance: 5%; RK PN: RC0402JR-07100KL; Priority: A; Wattage: 1/16W; Part Type: 通用厚膜电阻; Manufacturer PN: RC0402JR-07100KL; Created by: YTL
R338 = RESISTOR_0_Dup1: 通用厚膜电阻,0R,+/-5%,R0402,1/16W.; Manufacturer PN: RC0402JR-070RL; Manufacturer: YAGEO; Tolerance: 5%; Wattage: 1/16W; Priority: A; Created by: YTL; Part Type: 通用厚膜电阻; RK PN: RC0402JR-070RL
R344 = RESISTOR_0_Dup6
RP2 = R-PACK4
U31 = AO4409_0
*#10 = radxa_1010: Page Create Date: March  8, 1995

## Sheet 12.SchDoc
size 297 x 209 mm
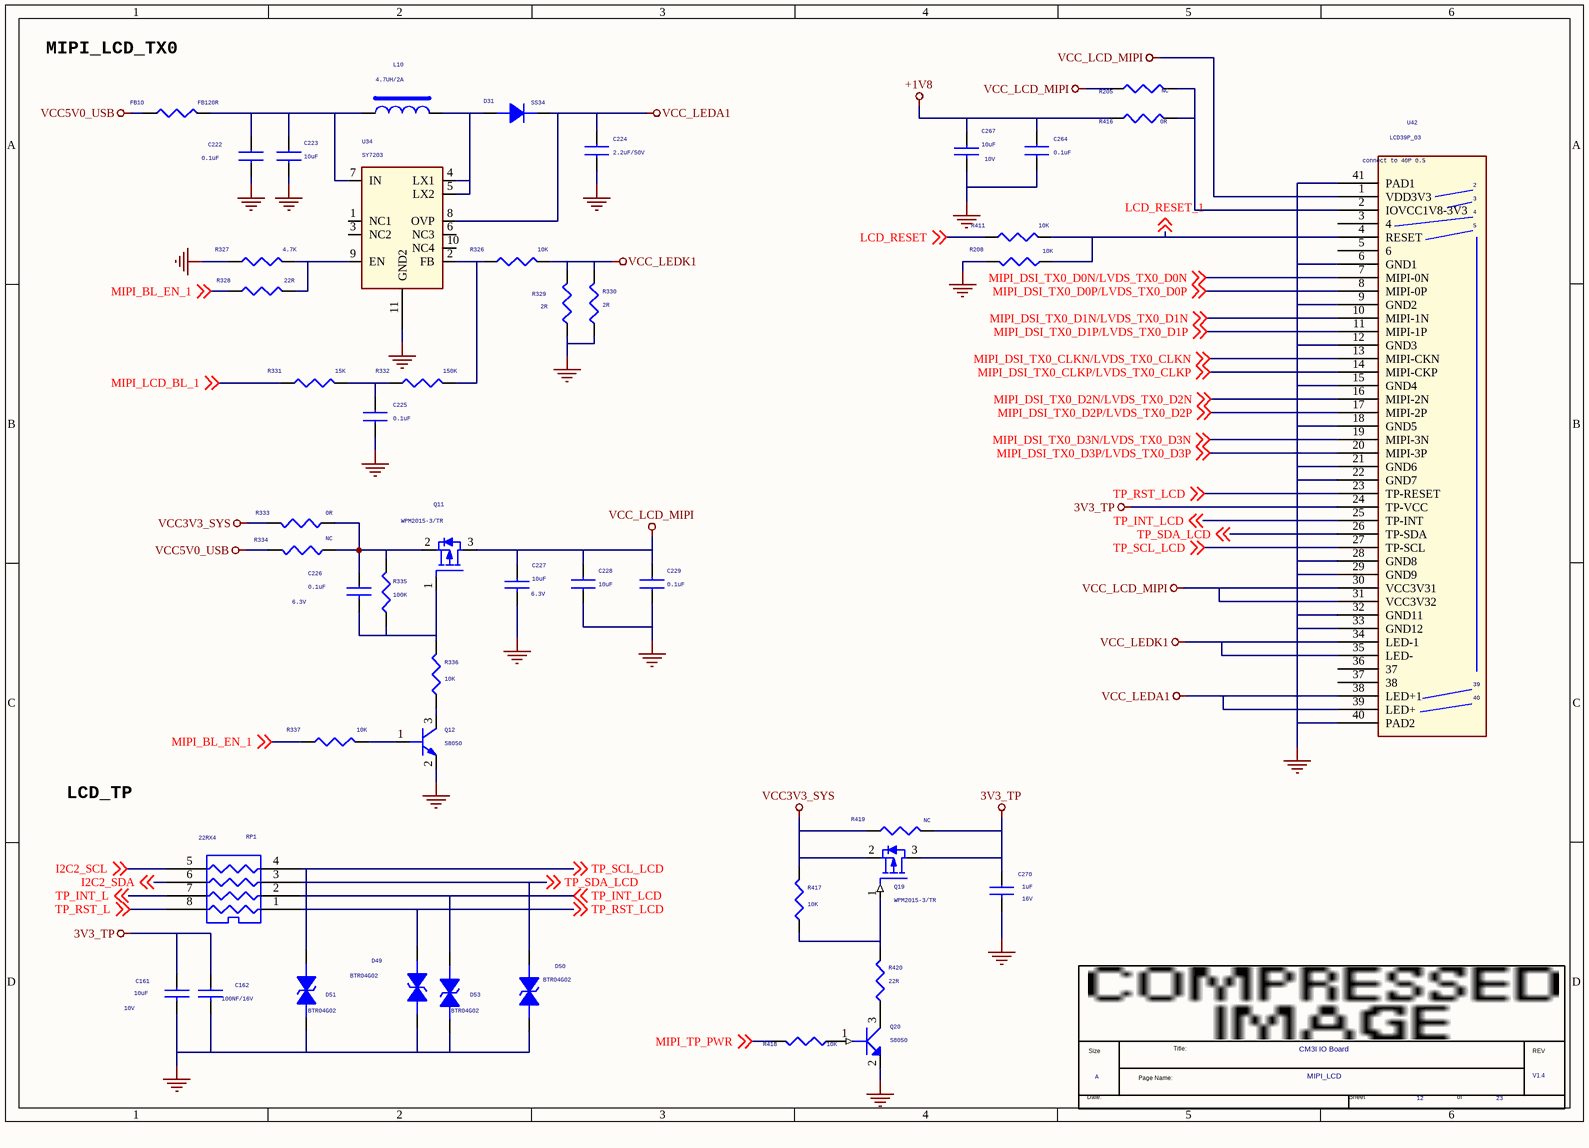
[diagram p10: 12.SchDoc]

### Parts
(Parts that share a designator on the sheet are numbered #1, #2 ... from top to bottom, then left to right.)
*#11  Page Count: 23  Page Number: 12  Page Size: A  Title: CM3I IO Board  RevCode: V1.4  Doc: MIPI_LCD  (hidden comment: radxa_1010)  (graphical)
C161  10uF  Voltage: 10V  [C0603]
C162  100NF/16V  [C0201]
C222  0.1uF  [C0603]
C223  10uF  [C0603]
C224  2.2uF/50V  [C0603]
C225  0.1uF  [C0603]
C226  0.1uF  Voltage: 6.3V  [C0402]
C227  10uF  Voltage: 6.3V  [C0603]
C228  10uF  [C0603]
C229  0.1uF  [C0603]
C264  0.1uF  [C0603]
C267  10uF  Voltage: 10V  [C0603]
C270  1uF  Voltage: 16V  [C0402]
D31  SS34  [DO214AC]
D49  BTR04G02  [ESD0402_1xD5]
D50  BTR04G02  [ESD0402_1xD5]
D51  BTR04G02  [ESD0402_1xD5]
D53  BTR04G02  [ESD0402_1xD5]
FB10  FB120R  [R0603]
L10  4.7UH/2A  [IND-4X4]
Q11  WPM2015-3/TR  [SOT23]
Q12  S8050  [SOT23]
Q19  WPM2015-3/TR  [SOT23]
Q20  S8050  [SOT23]
R205  NC  [R0402]
R208  10K  [R0201]
R326  10K  [R0402]
R327  4.7K  [R0402]
R328  22R  [R0402]
R329  2R  [R0805]
R330  2R  [R0805]
R331  15K  [R0402]
R332  150K  [R0402]
R333  0R  [R0603]
R334  NC  [R0603]
R335  100K  [R0402]
R336  10K  [R0402]
R337  10K  [R0402]
R411  10K  [R0201]
R416  0R  [R0402]
R417  10K  [R0402]
R418  10K  [R0402]
R419  NC  [R0402]
R420  22R  [R0402]
RP1  22RX4  [RN8P4RC]
U34  SY7203  [QFN8-2X2]
U42  LCD39P_03  [LCD39PIN-ok]

### Nets
3V3_TP: C161.1 C162.1 C270.1 Q19.3(DRAIN) R419.2 U42.24(TP-VCC)
+1V8: C264.1 C267.1 R416.1
GND: C161.2 C162.2 C222.2 C223.2 C224.2 C225.1 C227.2 C228.2 C229.2 C264.2 C267.2 C270.2 D49.2 D50.2 D51.2 D53.2 Q12.2(EMITTER) Q20.2(E) R208.2 R327.1 R329.2 R330.2 U34.11(GND2) U42.6(GND1) U42.9(GND2) U42.12(GND3) U42.15(GND4) U42.18(GND5) U42.21(GND6) U42.22(GND7) U42.28(GND8) U42.29(GND9) U42.32(GND11) U42.33(GND12) U42.40(PAD2) U42.41(PAD1)
VCC3V3_SYS: Q19.2(SOURCE) R333.1 R417.2 R419.1
VCC5V0_USB: FB10.1 R334.1
VCC_LCD_MIPI: C227.1 C228.1 C229.1 Q11.3(DRAIN) R205.1 U42.1(VDD3V3) U42.30(VCC3V31) U42.31(VCC3V32)
VCC_LEDA1: C224.1 D31.2(K) U34.8(OVP) U42.38(LED+1) U42.39(LED+)
VCC_LEDK1: R326.2 R329.1 R330.1 U42.34(LED-1) U42.35(LED-)
I2C2_SCL: RP1.5(R4) ; off-sheet I2C2_SCL
I2C2_SDA: RP1.6(R3) ; off-sheet I2C2_SDA
LCD_RESET: R411.1 ; off-sheet LCD_RESET
LCD_RESET_1: R208.1 R411.2 U42.4(RESET) ; off-sheet LCD_RESET_1
MIPI_BL_EN_1: R328.1 R337.1 ; off-sheet MIPI_BL_EN_1
MIPI_DSI_TX0_CLKN/LVDS_TX0_CLKN: U42.13(MIPI-CKN) ; off-sheet MIPI_DSI_TX0_CLKN/LVDS_TX0_CLKN
MIPI_DSI_TX0_CLKP/LVDS_TX0_CLKP: U42.14(MIPI-CKP) ; off-sheet MIPI_DSI_TX0_CLKP/LVDS_TX0_CLKP
MIPI_DSI_TX0_D0N/LVDS_TX0_D0N: U42.7(MIPI-0N) ; off-sheet MIPI_DSI_TX0_D0N/LVDS_TX0_D0N
MIPI_DSI_TX0_D0P/LVDS_TX0_D0P: U42.8(MIPI-0P) ; off-sheet MIPI_DSI_TX0_D0P/LVDS_TX0_D0P
MIPI_DSI_TX0_D1N/LVDS_TX0_D1N: U42.10(MIPI-1N) ; off-sheet MIPI_DSI_TX0_D1N/LVDS_TX0_D1N
MIPI_DSI_TX0_D1P/LVDS_TX0_D1P: U42.11(MIPI-1P) ; off-sheet MIPI_DSI_TX0_D1P/LVDS_TX0_D1P
MIPI_DSI_TX0_D2N/LVDS_TX0_D2N: U42.16(MIPI-2N) ; off-sheet MIPI_DSI_TX0_D2N/LVDS_TX0_D2N
MIPI_DSI_TX0_D2P/LVDS_TX0_D2P: U42.17(MIPI-2P) ; off-sheet MIPI_DSI_TX0_D2P/LVDS_TX0_D2P
MIPI_DSI_TX0_D3N/LVDS_TX0_D3N: U42.19(MIPI-3N) ; off-sheet MIPI_DSI_TX0_D3N/LVDS_TX0_D3N
MIPI_DSI_TX0_D3P/LVDS_TX0_D3P: U42.20(MIPI-3P) ; off-sheet MIPI_DSI_TX0_D3P/LVDS_TX0_D3P
MIPI_LCD_BL_1: R331.1 ; off-sheet MIPI_LCD_BL_1
MIPI_TP_PWR: R418.2 ; off-sheet MIPI_TP_PWR
TP_INT_L: RP1.7(R2) ; off-sheet TP_INT_L
TP_INT_LCD: D53.1 RP1.2(R2) U42.25(TP-INT) ; off-sheet TP_INT_LCD
TP_RST_L: RP1.8(R1) ; off-sheet TP_RST_L
TP_RST_LCD: D49.1 RP1.1(R1) U42.23(TP-RESET) ; off-sheet TP_RST_LCD
TP_SCL_LCD: D51.1 RP1.4(R4) U42.27(TP-SCL) ; off-sheet TP_SCL_LCD
TP_SDA_LCD: D50.1 RP1.3(R3) U42.26(TP-SDA) ; off-sheet TP_SDA_LCD
NetC222_1: C222.1 C223.1 FB10.2 L10.1 U34.7(IN)
NetC225_2: C225.2 R331.2 R332.1
NetC226_1: C226.1 Q11.2(SOURCE) R333.2 R334.2 R335.1
NetC226_2: C226.2 Q11.1(GATE) R335.2 R336.1
NetD31_1: D31.1(A) L10.2 U34.4(LX1) U34.5(LX2)
NetQ12_1: Q12.1(BASE) R337.2
NetQ12_3: Q12.3(COLLECTOR) R336.2
NetQ19_1: Q19.1(GATE) R417.1 R420.2
NetQ20_1: Q20.1(B) R418.1
NetQ20_3: Q20.3(C) R420.1
NetR205_2: R205.2 R416.2 U42.2(IOVCC1V8-3V3)
NetR326_1: R326.1 R332.2 U34.2(FB)
NetR327_2: R327.2 R328.2 U34.9(EN)

Not connected (* = marked no-connect by the designer): U34 1(NC1) 3(NC2) 6(NC3) 10(NC4); U42 3(4) 5(6) 36(37) 37(38)

### Notes on the sheet
- MIPI_LCD_TX0
- LCD_TP
- (in symbol LCD39P_03) connect to 40P 0.5
- (in symbol radxa_1010) Size; Title:; REV; Page Name:; Date:; Sheet; of

### Library data of the parts
C161 = CAP NP_0_Dup3: cap,10.00uF,+/-10%,10V,X5R,C0603; Manufacturer PN: C1608X5R1A106K080AC; Manufacturer: TDK; Tolerance: 10%; Priority: A; Dielectric: X5R; Created by: JJJ; Part Type: C0603; RK PN: C1608X5R1A106K080AC
C162 = CAP NP_0_Dup3: cap,100.00nF,+/-10%,16V,X5R,C0402; Manufacturer: TDK; RK PN: C1005X5R1C104K050BA; Priority: A; Tolerance: 10%; Voltage: 16V; Dielectric: X5R; Part Type: C0402; Manufacturer PN: C1005X5R1C104K050BA; Created by: JJJ
C222 C229 C264 = CAP NP_Dup2: CAP,MLCC,100nF,+/-10%,X7R,6.3V,SMD0402
C223 = CAP NP_Dup2
C224 = CAP NP_Dup2: RoHS CHIP CAP 1uF +10/-10% 25V X5R
C225 = CAP NP_Dup2: RoHS CHIP CAP 0.1uF +10/-10% X7R
C226 = CAP NP_0: as C205 on sheet 11; Dielectric: X5R; Part Type: C0402; Manufacturer PN: C1005X5R0J104K050BA; Created by: JJJ
C227 = CAP NP_0: as C208 on sheet 11; Dielectric: X5R; Created by: JJJ; Part Type: C0603; RK PN: C1608X5R0J475K080AB
C228 = CAP NP_Dup2: CAP,MLCC,4.7uF,+/-10%,X5R,6.3V,SMD0603
C267 = CAP NP_0_Dup3: cap,10.00uF,+/-10%,10V,X5R,C0805; Manufacturer PN: C2012X5R1A106K125AB; Manufacturer: TDK; Tolerance: 10%; Priority: A; Dielectric: X5R; Created by: JJJ; Part Type: C0805; RK PN: C2012X5R1A106K125AB
C270 = CAP NP_0: cap,100.00nF,+/-10%,6.3V,X5R,C0402; Manufacturer PN: C1005X5R0J104K050BA; Manufacturer: TDK; Tolerance: 10%; Priority: A; Dielectric: X5R; Created by: JJJ; Part Type: C0402; RK PN: C1005X5R0J104K050BA
D31 = DIODE
D49 D53 = DIODE BI_DIR TRIG_0: as D33 on sheet 11; Part Type: ESD_TVS; Manufacturer PN: ESD5451N; Created by: JJJ
D50 D51 = DIODE BI_DIR TRIG_0: as D32 on sheet 11; Created by: JJJ; Part Type: ESD_TVS; RK PN: ESD5451N
FB10 R208 R327 R331 R332 R411 = RES 1B: ROHS CHIP RES 4.7K 1/16W 5%
L10 = INDUCTORS OF FERRITE
Q11 = MOSFET P_Dup1: PMOS,WPM2015-3/TR,SOT23,Id=2.4A,Vds=20V; Manufacturer: WillSemi(韦尔半导体); Priority: A; Id: 2.4A; Vgs: ±8V; VDS: 20V; Vgsth: 0.62V; Pd: 0.5W; RK PN: WPM2015-3/TR; Part Type: PMOS; Manufacturer PN: WPM2015-3/TR; Created by: JJJ
Q12 = NPN: as Q5 on sheet 11; RK PN: S8050; Part Type: NPN; Created by: JJJ
Q19 = MOSFET P: PMOS,WPM2015-3/TR,SOT_23,Id=2.4A,Vds=20V; Manufacturer: WillSemi(韦尔半导体); option: DNP; Pd: 0.5W; Vgsth: 0.62V; VDS: 20V; Vgs: ±8V; Id_max: 2.4A; Priority: A; ROOM: CHG; Created by: JJJ; Manufacturer PN: WPM2015-3/TR; Part Type: PMOS; RK PN: WPM2015-3/TR
Q20 = NPN4
R205 = RESISTOR_0_Dup4: 通用厚膜电阻,100K,+/-5%,R0402,1/16W.; Manufacturer PN: RC0402JR-07100KL; Manufacturer: YAGEO; Tolerance: 5%; Wattage: 1/16W; Priority: A; Created by: YTL; Part Type: 通用厚膜电阻; RK PN: RC0402JR-07100KL
R326 = RES 1B: ROHS CHIP RES 82K 1/16W 5%
R328 R337 R417 = RESISTOR_0_Dup1: as R290 on sheet 11; Part Type: 通用厚膜电阻; Manufacturer PN: RC0402JR-0710KL; Created by: YTL
R329 R330 R333 R334 = RES 1B: ROHS CHIP RES 4.7R 1/4W 5%
R335 R418 = RESISTOR_0_Dup1: as R301 on sheet 11; Part Type: 通用厚膜电阻; Manufacturer PN: RC0402JR-07100KL; Created by: YTL
R336 = RESISTOR_0_Dup1: as R291 on sheet 11; Created by: YTL; Part Type: 通用厚膜电阻; RK PN: RC0402JR-0710KL
R416 = RESISTOR_0_Dup4: 通用厚膜电阻,100K,+/-5%,R0402,1/16W.; Manufacturer: YAGEO; Tolerance: 5%; RK PN: RC0402JR-07100KL; Priority: A; Wattage: 1/16W; Part Type: 通用厚膜电阻; Manufacturer PN: RC0402JR-07100KL; Created by: YTL
R419 = RESISTOR_0_Dup1: as R338 on sheet 11; Created by: YTL; Part Type: 通用厚膜电阻; RK PN: RC0402JR-070RL
R420 = RESISTOR_0_Dup6
RP1 = R-PACK4
U34 = MP3202-QFN8_1
*#11 = radxa_1010: Page Create Date: March  8, 1995

## Sheet 13.SchDoc
size 297 x 209 mm
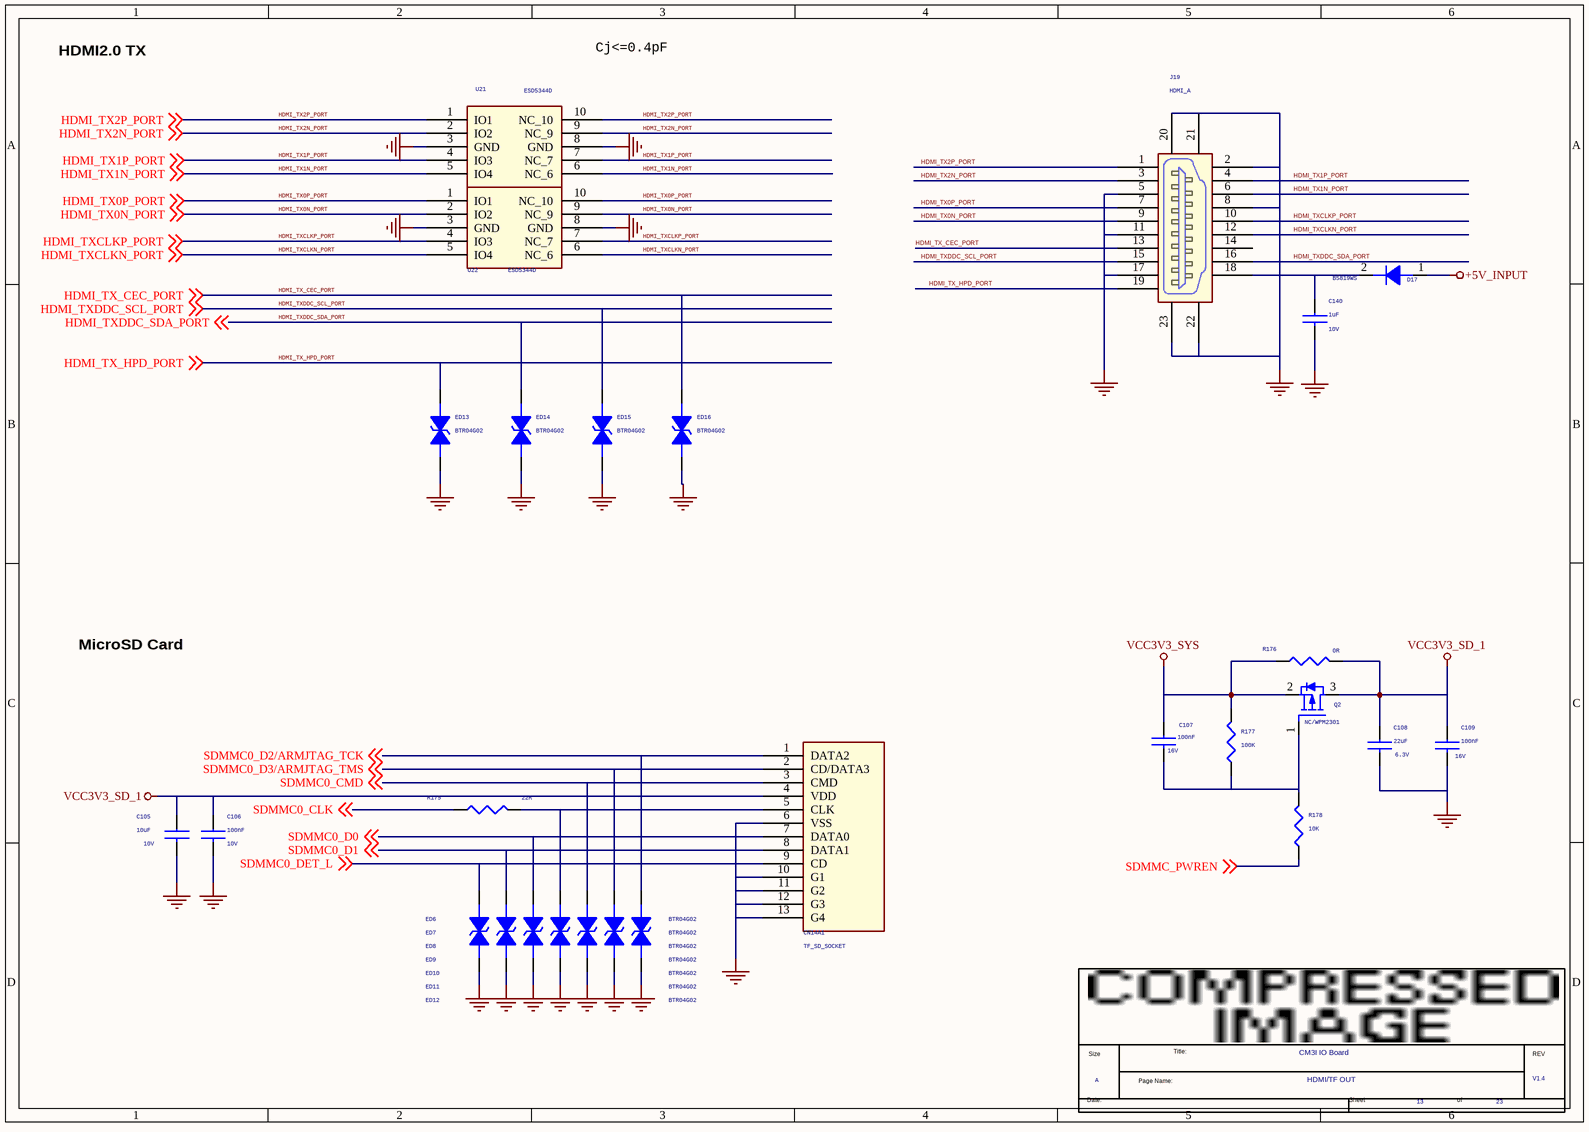
[diagram p11: 13.SchDoc]

### Parts
(Parts that share a designator on the sheet are numbered #1, #2 ... from top to bottom, then left to right.)
*#12  Page Count: 23  Page Number: 13  Page Size: A  Title: CM3I IO Board  RevCode: V1.4  Doc: HDMI/TF OUT  (hidden comment: radxa_1010)  (graphical)
C105  10uF  Voltage: 10V  [C0603]
C106  100nF  Voltage: 10V  [C0402]
C107  100nF  Voltage: 16V  [C0402]
C108  22uF  Voltage: 6.3V  [C0603]
C109  100nF  Voltage: 16V  [C0402]
C140  1uF  Voltage: 10V  [C0402]
CN14A1  TF_SD_SOCKET  [TF-CKT01-009D]
D17  B5819WS  [SOD_323]
ED6  BTR04G02  [E0402N]
ED7  BTR04G02  [E0402N]
ED8  BTR04G02  [E0402N]
ED9  BTR04G02  [E0402N]
ED10  BTR04G02  [E0402N]
ED11  BTR04G02  [E0402N]
ED12  BTR04G02  [E0402N]
ED13  BTR04G02  [ESD0402_1xD5]
ED14  BTR04G02  [ESD0402_1xD5]
ED15  BTR04G02  [ESD0402_1xD5]
ED16  BTR04G02  [ESD0402_1xD5]
J19  HDMI_A  [HDMIA19S]
Q2  NC/WPM2301  [SOT23]
R175  22R  [R0402]
R176  0R  [R0402]
R177  100K  [R0402]
R178  10K  [R0402]
U21  ESD5344D  [SON10_2R50X1R00X0R50]
U22  ESD5344D  [SON10_2R50X1R00X0R50]

### Nets
+5V_INPUT: D17.1(A)
GND: C105.2 C106.2 C108.2 C109.2 C140.2 CN14A1.6(VSS) CN14A1.10(G1) CN14A1.11(G2) CN14A1.12(G3) CN14A1.13(G4) ED6.2 ED7.2 ED8.2 ED9.2 ED10.2 ED11.2 ED12.2 ED13.2 ED14.2 ED15.2 ED16.2 J19.2 J19.5 J19.8 J19.11 J19.17 J19.20 J19.21 J19.22 J19.23 U21.3(GND) U21.8(GND) U22.3(GND) U22.8(GND)
VCC3V3_SD_1: C105.1 C106.1 C108.1 C109.1 CN14A1.4(VDD) Q2.3(DRAIN) R176.2
VCC3V3_SYS: C107.1 Q2.2(SOURCE) R176.1 R177.1
HDMI_TX0N_PORT: J19.9 U22.2(IO2) U22.9(NC_9) ; off-sheet HDMI_TX0N_PORT
HDMI_TX0P_PORT: J19.7 U22.1(IO1) U22.10(NC_10) ; off-sheet HDMI_TX0P_PORT
HDMI_TX1N_PORT: J19.6 U21.5(IO4) U21.6(NC_6) ; off-sheet HDMI_TX1N_PORT
HDMI_TX1P_PORT: J19.4 U21.4(IO3) U21.7(NC_7) ; off-sheet HDMI_TX1P_PORT
HDMI_TX2N_PORT: J19.3 U21.2(IO2) U21.9(NC_9) ; off-sheet HDMI_TX2N_PORT
HDMI_TX2P_PORT: J19.1($PIN0) U21.1(IO1) U21.10(NC_10) ; off-sheet HDMI_TX2P_PORT
HDMI_TX_CEC_PORT: ED16.1 J19.13 ; off-sheet HDMI_TX_CEC_PORT
HDMI_TX_HPD_PORT: ED13.1 J19.19 ; off-sheet HDMI_TX_HPD_PORT
HDMI_TXCLKN_PORT: J19.12 U22.5(IO4) U22.6(NC_6) ; off-sheet HDMI_TXCLKN_PORT
HDMI_TXCLKP_PORT: J19.10 U22.4(IO3) U22.7(NC_7) ; off-sheet HDMI_TXCLKP_PORT
HDMI_TXDDC_SCL_PORT: ED15.1 J19.15 ; off-sheet HDMI_TXDDC_SCL_PORT
HDMI_TXDDC_SDA_PORT: ED14.1 J19.16 ; off-sheet HDMI_TXDDC_SDA_PORT
SDMMC0_CLK: R175.1 ; off-sheet SDMMC0_CLK
SDMMC0_CMD: CN14A1.3(CMD) ED10.1 ; off-sheet SDMMC0_CMD
SDMMC0_D0: CN14A1.7(DATA0) ED8.1 ; off-sheet SDMMC0_D0
SDMMC0_D1: CN14A1.8(DATA1) ED7.1 ; off-sheet SDMMC0_D1
SDMMC0_D2/ARMJTAG_TCK: CN14A1.1(DATA2) ED12.1 ; off-sheet SDMMC0_D2/ARMJTAG_TCK
SDMMC0_D3/ARMJTAG_TMS: CN14A1.2(CD/DATA3) ED11.1 ; off-sheet SDMMC0_D3/ARMJTAG_TMS
SDMMC0_DET_L: CN14A1.9(CD) ED6.1 ; off-sheet SDMMC0_DET_L
SDMMC_PWREN: R178.2 ; off-sheet SDMMC_PWREN
NetC107_2: C107.2 Q2.1(GATE) R177.2 R178.1
NetC140_1: C140.1 D17.2(K) J19.18
NetCN14A1_5: CN14A1.5(CLK) ED9.1 R175.2

Not connected (* = marked no-connect by the designer): J19 14

### Notes on the sheet
- HDMI2.0 TX
- Cj<=0.4pF
- MicroSD Card
- (in symbol radxa_1010) Title:; Size; REV; Page Name:; Date:; Sheet; of

### Library data of the parts
C105 = CAP NP_0: cap,10.00uF,+/-10%,10V,X5R,C0603; Manufacturer: TDK; RK PN: C1608X5R1A106K080AC; Priority: A; C_Voltage: 6.3V; Tolerance: 10%; Dielectric: X5R; Part Type: C0603; Manufacturer PN: C1608X5R1A106K080AC; Created by: JJJ
C106 = CAP NP_0: cap,100.00nF,+/-10%,10V,X5R,C0402; Manufacturer: TDK; RK PN: C1005X5R1A104K050BA; Priority: A; Tolerance: 10%; C_Voltage: 6.3V; Dielectric: X5R; Part Type: C0402; Manufacturer PN: C1005X5R1A104K050BA; Created by: JJJ
C107 C109 = CAP NP_0: cap,100.00nF,+/-10%,16V,X5R,C0402; Manufacturer PN: C1005X5R1C104K050BA; Manufacturer: TDK; Tolerance: 10%; Priority: A; Dielectric: X5R; Created by: JJJ; Part Type: C0402; RK PN: C1005X5R1C104K050BA
C108 = CAP NP_0: as C206 on sheet 11; Dielectric: X5R; Part Type: C0603; Manufacturer PN: C1608X5R0J106K080AB; Created by: JJJ
C140 = CAP NP_0: cap,1.00uF,+/-10%,10V,X5R,C0402; Manufacturer PN: C1005X5R1A105K050BB; Manufacturer: TDK; Tolerance: 10%; Priority: A; Dielectric: X5R; Created by: JJJ; Part Type: C0402; RK PN: C1005X5R1A105K050BB
CN14A1 = SD_SOCKET_0
D17 = DIODE_Dup2: Schottky Barrier，B5819WS SOD-323; Manufacturer: 长电; Priority: A; RK PN: B5819WS; Part Type: Schottky rectifier; Manufacturer PN: B5819WS; Created by: JJJ
ED6-ED12 = DIODE BI-DIR TRIG: ESD
ED13-ED16 = DIODE BI_DIR TRIG_0: 1-Line, Bi-directional, Transient Voltage Suppressors.17.5pF.; Manufacturer: WillSemi(韦尔半导体); RK PN: ESD5451N; Priority: A; Part Type: ESD_TVS; Manufacturer PN: ESD5451N; Created by: JJJ
J19 = HDMI_A: 通用A型HDMI座,卧式,侧插; Manufacturer: 旺科达; Priority: A; RK PN: HDMI_A; Part Type: HDMI Jack; Manufacturer Part Number: HDMI_A; Created by: JJJ
Q2 = MOSFET P_Dup1: as Q6 on sheet 11; Created by: JJJ; Manufacturer PN: WPM3407-3/TR; Part Type: PMOS; RK PN: WPM3407-3/TR
R175 = RESISTOR_1_Dup1
R176 = RESISTOR_0_Dup1: as R338 on sheet 11; Created by: YTL; Part Type: 通用厚膜电阻; RK PN: RC0402JR-070RL
R177 = RESISTOR_0_Dup1: as R301 on sheet 11; Part Type: 通用厚膜电阻; Manufacturer PN: RC0402JR-07100KL; Created by: YTL
R178 = RESISTOR_0_Dup1: as R290 on sheet 11; Part Type: 通用厚膜电阻; Manufacturer PN: RC0402JR-0710KL; Created by: YTL
U21 U22 = ESD_ESD5304D: 4-Lines, Uni-directional, Ultra-low Capacitance Transient Voltage Suppressors; Manufacturer: WillSemi(韦尔半导体); Priority: A; RK PN: ESD5304D; Part Type: ESD_TVS; Manufacturer PN: ESD5304D; Created by: JJJ
*#12 = radxa_1010: Page Create Date: March  8, 1995

## Sheet 14.SchDoc
size 297 x 209 mm
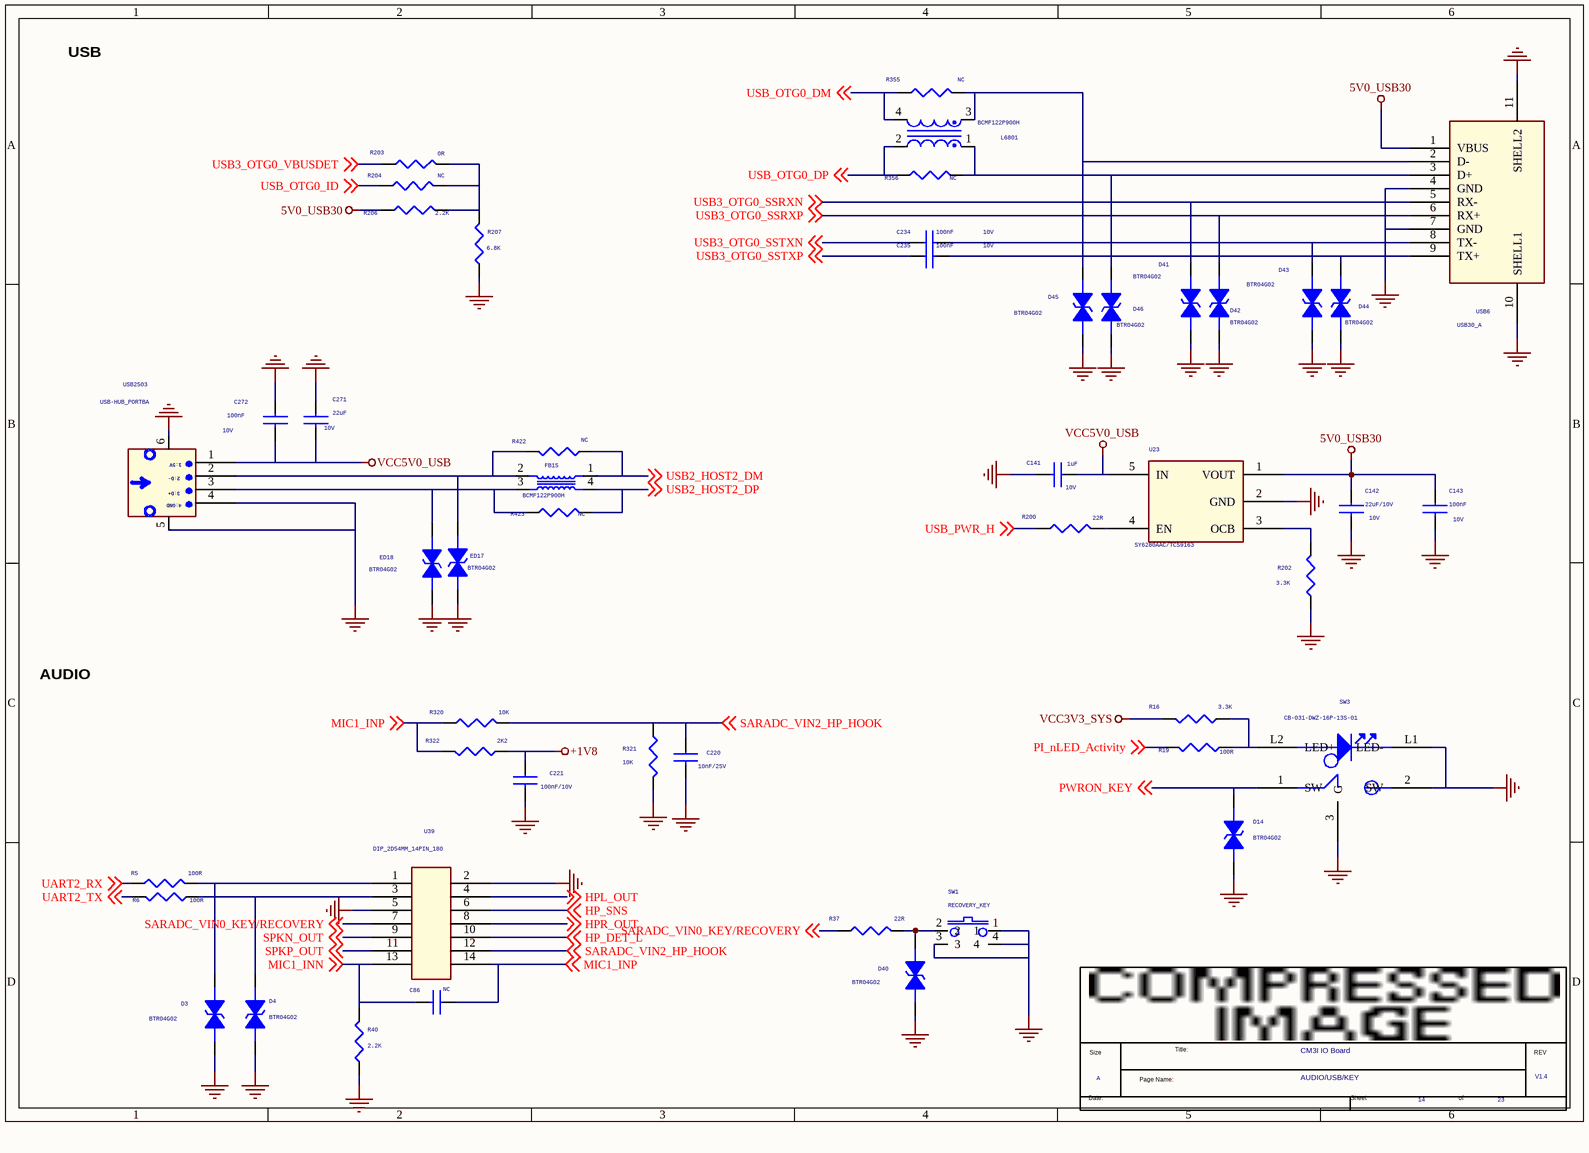
[diagram p12: 14.SchDoc]

### Parts
(Parts that share a designator on the sheet are numbered #1, #2 ... from top to bottom, then left to right.)
*#13  Page Count: 23  Page Number: 14  Page Size: A  Title: CM3I IO Board  RevCode: V1.4  Doc: AUDIO/USB/KEY  (hidden comment: radxa_1010)  (graphical)
C86  NC  [C0402]
C141  1uF  Voltage: 10V  [C0402]
C142  22uF/10V  Voltage: 10V  [C0603]
C143  100nF  Voltage: 10V  [C0402]
C220  10nF/25V  [C0402]
C221  100nF/10V  [C0402]
C234  100nF  Voltage: 10V  [C0402]
C235  100nF  Voltage: 10V  [C0402]
C271  22uF  Voltage: 10V  [C0603]
C272  100nF  Voltage: 10V  [C0402]
D3  BTR04G02  [ESD0402_1xD5]
D4  BTR04G02  [ESD0402_1xD5]
D14  BTR04G02  [ESD0402_1xD5]
D40  BTR04G02  [ESD0402_1xD5]
D41  BTR04G02  [ESD0402_1xD5]
D42  BTR04G02  [ESD0402_1xD5]
D43  BTR04G02  [ESD0402_1xD5]
D44  BTR04G02  [ESD0402_1xD5]
D45  BTR04G02  [ESD0402_1xD5]
D46  BTR04G02  [ESD0402_1xD5]
ED17  BTR04G02  [ESD0402_1xD5]
ED18  BTR04G02  [ESD0402_1xD5]
FB15  BCMF122P900H  [GMDG-4PIN_ESD]
L6801  BCMF122P900H  [L0402D]
R5  100R  [R0402]
R6  100R  [R0402]
R16  3.3K  [R0402]
R19  100R  [R0402]
R37  22R  [R0402]
R40  2.2K  [R0402]
R200  22R  [R0402]
R202  3.3K  [R0402]
R203  0R  [R0402]
R204  NC  [R0402]
R206  2.2K  [R0402]
R207  6.8K  [R0603]
R320  10K  [R0402]
R321  10K  [R0402]
R322  2K2  [R0402]
R355  NC  [R0402]
R356  NC  [R0402]
R422  NC  [R0402]
R423  NC  [R0402]
SW1  RECOVERY_KEY  [SW_4_DIP]
SW3  CB-031-DWZ-16P-13S-01  [DIP_SWITCH]
U23  SY6280AAC/TCS9163  [SOT_23_5]
U39  DIP_2D54MM_14PIN_180  [DIP_14PIN-2_54MM]
USB6  USB30_A  [USB30]
USB2503  USB-HUB_PORTBA  [USB20]

### Nets
5V0_USB30: C142.1 C143.1 R206.2 U23.1(VOUT) USB6.1(VBUS)
+1V8: C221.1 R322.2
GND: C141.2 C142.2 C143.2 C220.2 C221.2 C271.1 C272.1 D3.1 D4.1 D14.1 D40.1 D41.1 D42.1 D43.1 D44.1 D45.1 D46.1 ED17.2 ED18.2 R40.1 R202.2 R207.2 R321.1 SW1.1 SW1.3 SW1.4 SW3.2(SW) SW3.3(G) SW3.L1(LED-) U23.2(GND) U39.2 U39.5 USB6.4(GND) USB6.7(GND) USB6.10(SHELL1) USB6.11(SHELL2) USB2503.4 USB2503.5 USB2503.6
VCC3V3_SYS: R16.1
VCC5V0_USB: C141.1 C271.2 C272.2 U23.5(IN) USB2503.1
HP_DET_L: U39.10 ; off-sheet HP_DET_L
HP_SNS: U39.6 ; off-sheet HP_SNS
HPL_OUT: U39.4 ; off-sheet HPL_OUT
HPR_OUT: U39.8 ; off-sheet HPR_OUT
MIC1_INN: C86.2 R40.2 U39.13 ; off-sheet MIC1_INN
MIC1_INP: C86.1 R320.2 R322.1 U39.14 ; off-sheet MIC1_INP
PI_nLED_Activity: R19.2 ; off-sheet PI_nLED_Activity
PWRON_KEY: D14.2 SW3.1(SW) ; off-sheet PWRON_KEY
SARADC_VIN0_KEY/RECOVERY: R37.1 U39.7 ; off-sheet SARADC_VIN0_KEY/RECOVERY
SARADC_VIN2_HP_HOOK: C220.1 R320.1 R321.2 U39.12 ; off-sheet SARADC_VIN2_HP_HOOK
SPKN_OUT: U39.9 ; off-sheet SPKN_OUT
SPKP_OUT: U39.11 ; off-sheet SPKP_OUT
UART2_RX: R5.1 ; off-sheet UART2_RX
UART2_TX: R6.1 ; off-sheet UART2_TX
USB2_HOST2_DM: FB15.1(R1) R422.1 ; off-sheet USB2_HOST2_DM
USB2_HOST2_DP: FB15.4(R2) R423.1 ; off-sheet USB2_HOST2_DP
USB3_OTG0_SSRXN: D41.2 USB6.5(RX-) ; off-sheet USB3_OTG0_SSRXN
USB3_OTG0_SSRXP: D42.2 USB6.6(RX+) ; off-sheet USB3_OTG0_SSRXP
USB3_OTG0_SSTXN: C234.1 ; off-sheet USB3_OTG0_SSTXN
USB3_OTG0_SSTXP: C235.1 ; off-sheet USB3_OTG0_SSTXP
USB3_OTG0_VBUSDET: R203.2 ; off-sheet USB3_OTG0_VBUSDET
USB_OTG0_DM: L6801.4 R355.2 ; off-sheet USB_OTG0_DM
USB_OTG0_DP: L6801.2 R356.2 ; off-sheet USB_OTG0_DP
USB_OTG0_ID: R204.2 ; off-sheet USB_OTG0_ID
USB_PWR_H: R200.2 ; off-sheet USB_PWR_H
NetC234_2: C234.2 D43.2 USB6.8(TX-)
NetC235_2: C235.2 D44.2 USB6.9(TX+)
NetD3_2: D3.2 R5.2 U39.1
NetD4_2: D4.2 R6.2 U39.3
NetD40_2: D40.2 R37.2 SW1.2
NetD45_2: D45.2 L6801.3 R355.1 USB6.2(D-)
NetD46_2: D46.2 L6801.1 R356.1 USB6.3(D+)
NetED17_1: ED17.1 FB15.2(R4) R422.2 USB2503.2
NetED18_1: ED18.1 FB15.3(R3) R423.2 USB2503.3
NetR16_2: R16.2 R19.1 SW3.L2(LED+)
NetR200_1: R200.1 U23.4(EN)
NetR202_1: R202.1 U23.3(OCB)
NetR203_1: R203.1 R204.1 R206.1 R207.1

### Notes on the sheet
- USB
- AUDIO
- (in symbol radxa_1010) Title:; Size; REV; Page Name:; Date:; Sheet; of
- (in symbol USB20_TYPE_A) 1:5V; 2:D-; 3:D+; 4:GND

### Library data of the parts
C86 = CAP NP_0: cap,12.00pF,+/-5%,50V,C0G,C0402; Manufacturer: TDK; RK PN: C1005C0G1H120J050BA; Priority: A; Tolerance: 5%; Voltage: 50V; Dielectric: C0G; Part Type: C0402; Manufacturer PN: C1005C0G1H120J050BA; Created by: JJJ
C141 = CAP NP_0: cap,1.00uF,+/-10%,10V,X5R,C0402; Manufacturer PN: C1005X5R1A105K050BB; Manufacturer: TDK; Tolerance: 10%; C_Voltage: 6.3V; Priority: A; Dielectric: X5R; Created by: JJJ; Part Type: C0402; RK PN: C1005X5R1A105K050BB
C142 C143 = CAP NP_0: cap,100.00nF,+/-10%,10V,X5R,C0402; Manufacturer PN: C1005X5R1A104K050BA; Manufacturer: TDK; Tolerance: 10%; Priority: A; Dielectric: X5R; Created by: JJJ; Part Type: C0402; RK PN: C1005X5R1A104K050BA
C220 = CAP_Dup1: RoHS CHIP CAP 0.01uF +10/-10% X7R
C221 = CAP_Dup1: RoHS CHIP CAP 0.1uF +10/-10% X7R
C234 = CAP NP_0: cap,100.00nF,+/-10%,10V,X5R,C0201; Manufacturer PN: C0603X5R1A104K030BC; Manufacturer: TDK; Tolerance: 10%; Priority: A; Dielectric: X5R; Created by: JJJ; Part Type: C0201; RK PN: C0603X5R1A104K030BC
C235 = CAP NP_0: cap,100.00nF,+/-10%,10V,X5R,C0201; Manufacturer: TDK; RK PN: C0603X5R1A104K030BC; Priority: A; Tolerance: 10%; Dielectric: X5R; Part Type: C0201; Manufacturer PN: C0603X5R1A104K030BC; Created by: JJJ
C271 = CAP NP_0_Dup2: cap,10.00uF,+/-10%,10V,X5R,C0805; Manufacturer PN: C2012X5R1A106K125AB; Manufacturer: TDK; Tolerance: 10%; Priority: A; Dielectric: X5R; Created by: JJJ; Part Type: C0805; RK PN: C2012X5R1A106K125AB
C272 = CAP NP_3: cap,100.00nF,+/-10%,10V,X5R,C0402; Manufacturer PN: C1005X5R1A104K050BA; Manufacturer: TDK; C_Voltage: 6.3V; Tolerance: 10%; Priority: A; Number: 37; Dielectric: X5R; Created by: JJJ; Part Type: C0402; RK PN: C1005X5R1A104K050BA
D3 D42 = DIODE BI_DIR TRIG_0: as D33 on sheet 11; Part Type: ESD_TVS; Manufacturer PN: ESD5451N; Created by: JJJ
D4 D14 D40 D41 D43-D46 = DIODE BI_DIR TRIG_0: as D32 on sheet 11; Created by: JJJ; Part Type: ESD_TVS; RK PN: ESD5451N
ED17 = DIODE BI_DIR TRIG_0: as ED13 on sheet 13; Part Type: ESD_TVS; Manufacturer PN: ESD5451N; Created by: JJJ
ED18 = DIODE BI_DIR TRIG_0: 1-Line, Bi-directional, Transient Voltage Suppressors.17.5pF.; Manufacturer PN: ESD5451N; Manufacturer: WillSemi(韦尔半导体); Priority: A; Created by: JJJ; Part Type: ESD_TVS; RK PN: ESD5451N
FB15 = R-PACK4_3
L6801 = INDUCTOR COM: Winding Type Common Mode Choke Coil; Manufacturer: sunlord; RK PN: SDCW2012-2-900TF; Priority: A; DC Resistor: 0.35ohm; Tolerance: 25%; Irms: 330mA; Resonace frequency: 90R@100M; Part Type: IND; Manufacturer PN: SDCW2012-2-900TF; Created by: JJJ
R5 = RESISTOR_2: 通用厚膜电阻,22R,+/-5%,R0402,1/16W.; Manufacturer: YAGEO; Tolerance: 5%; RK PN: RC0402JR-0722RL; Priority: A; Wattage: 1/16W; Part Type: 通用厚膜电阻; Manufacturer PN: RC0402JR-0722RL; Created by: YTL
R6 R40 = RESISTOR_2: 通用厚膜电阻,22R,+/-5%,R0402,1/16W.; Manufacturer PN: RC0402JR-0722RL; Manufacturer: YAGEO; Tolerance: 5%; Wattage: 1/16W; Priority: A; Created by: YTL; Part Type: 通用厚膜电阻; RK PN: RC0402JR-0722RL
R16 R19 = RESISTOR_2_Dup1: 通用厚膜电阻,330R,+/-5%,R0402,1/16W.; Manufacturer PN: RC0402JR-07330RL; Manufacturer: YAGEO; Tolerance: 5%; Wattage: 1/16W; Priority: A; Created by: YTL; Part Type: 通用厚膜电阻; RK PN: RC0402JR-07330RL
R37 = RESISTOR_0_Dup1: 通用厚膜电阻,10K,+/-5%,R0402,1/16W.; Manufacturer: YAGEO; Tolerance: 5%; RK PN: RC0402JR-0710KL; Priority: A; Wattage: 1/16W; option: DNP; Part Type: 通用厚膜电阻; Manufacturer PN: RC0402JR-0710KL; Created by: YTL
R200 R204 = RESISTOR_0_Dup1: 通用厚膜电阻,0R,+/-5%,R0402,1/16W.; Manufacturer: YAGEO; Tolerance: 5%; RK PN: RC0402JR-070RL; Priority: A; Wattage: 1/16W; Part Type: 通用厚膜电阻; Manufacturer PN: RC0402JR-070RL; Created by: YTL
R202 = RESISTOR_0_Dup1: 通用厚膜电阻,4K7,+/-5%,R0402,1/16W.; Manufacturer PN: RC0402JR-074K7L; Manufacturer: YAGEO; Tolerance: 5%; Wattage: 1/16W; Priority: A; Created by: YTL; Part Type: 通用厚膜电阻; RK PN: RC0402JR-074K7L
R203 R206 = RESISTOR_0_Dup1: as R338 on sheet 11; Created by: YTL; Part Type: 通用厚膜电阻; RK PN: RC0402JR-070RL
R207 = RES_0603
R320 R321 = RESISTOR_Dup2: ROHS CHIP RES 0R 1/16W 5%
R322 = RESISTOR_Dup2: ROHS CHIP RES 2K2 1/16W 5%
R355 = RESISTOR_0_Dup1: 通用厚膜电阻,4K7,+/-1%,R0402,1/16W.; Manufacturer PN: RC0402FR-074K7L; Manufacturer: YAGEO; Tolerance: 1%; Wattage: 1/16W; Priority: A; Created by: YTL; Part Type: 通用厚膜电阻; RK PN: RC0402FR-074K7L
R356 = RESISTOR_0_Dup1: 通用厚膜电阻,4K7,+/-1%,R0402,1/16W.; Manufacturer: YAGEO; Tolerance: 1%; RK PN: RC0402FR-074K7L; Priority: A; Wattage: 1/16W; Part Type: 通用厚膜电阻; Manufacturer PN: RC0402FR-074K7L; Created by: YTL
R422 R423 = RESISTOR_0_Dup3: 通用厚膜电阻,2R2,+/-5%,R0402,1/16W.; Manufacturer PN: RC0402JR-072R2L; Manufacturer: YAGEO; Tolerance: 5%; Wattage: 1/16W; Priority: A; Created by: YTL; Part Type: 通用厚膜电阻; RK PN: RC0402JR-072R2L
SW1 = KEY_0: Priority: A; Created by: YWQ; Part Type: KEY
SW3 = LED_0: 贴片LED灯，0603，绿色; Priority: A; RK PN: LED_GREEN; Created by: JJJ; Part Type: LED
U23 = SWITCH_SY6280: Low Loss Power Distribution Switch; Manufacturer: Silergy（矽力杰）; Priority: A; RK PN: SY6280AAC; Part Type: Switch; Manufacturer PN: SY6280AAC; Created by: JJJ
U39 = CON3_0
USB6 = USB30_TYPE_A: A型USB3.0座，卧式，插焊; Manufacturer: 旺科达; Priority: A; RK PN: USB-HOST_30; Created by: JJJ; Manufacturer Part Number: USB30_A; Part Type: USB Jack
USB2503 = USB20_TYPE_A: A型USB2.0座，卧式，插焊; Manufacturer: 旺科达; Priority: A; RK PN: USB-HOST_2.0; Created by: JJJ; Manufacturer Part Number: USB-HUB_PORTBA; Part Type: USB Jack
*#13 = radxa_1010: Page Create Date: March  8, 1995

## Sheet 15.SchDoc
size 297 x 209 mm
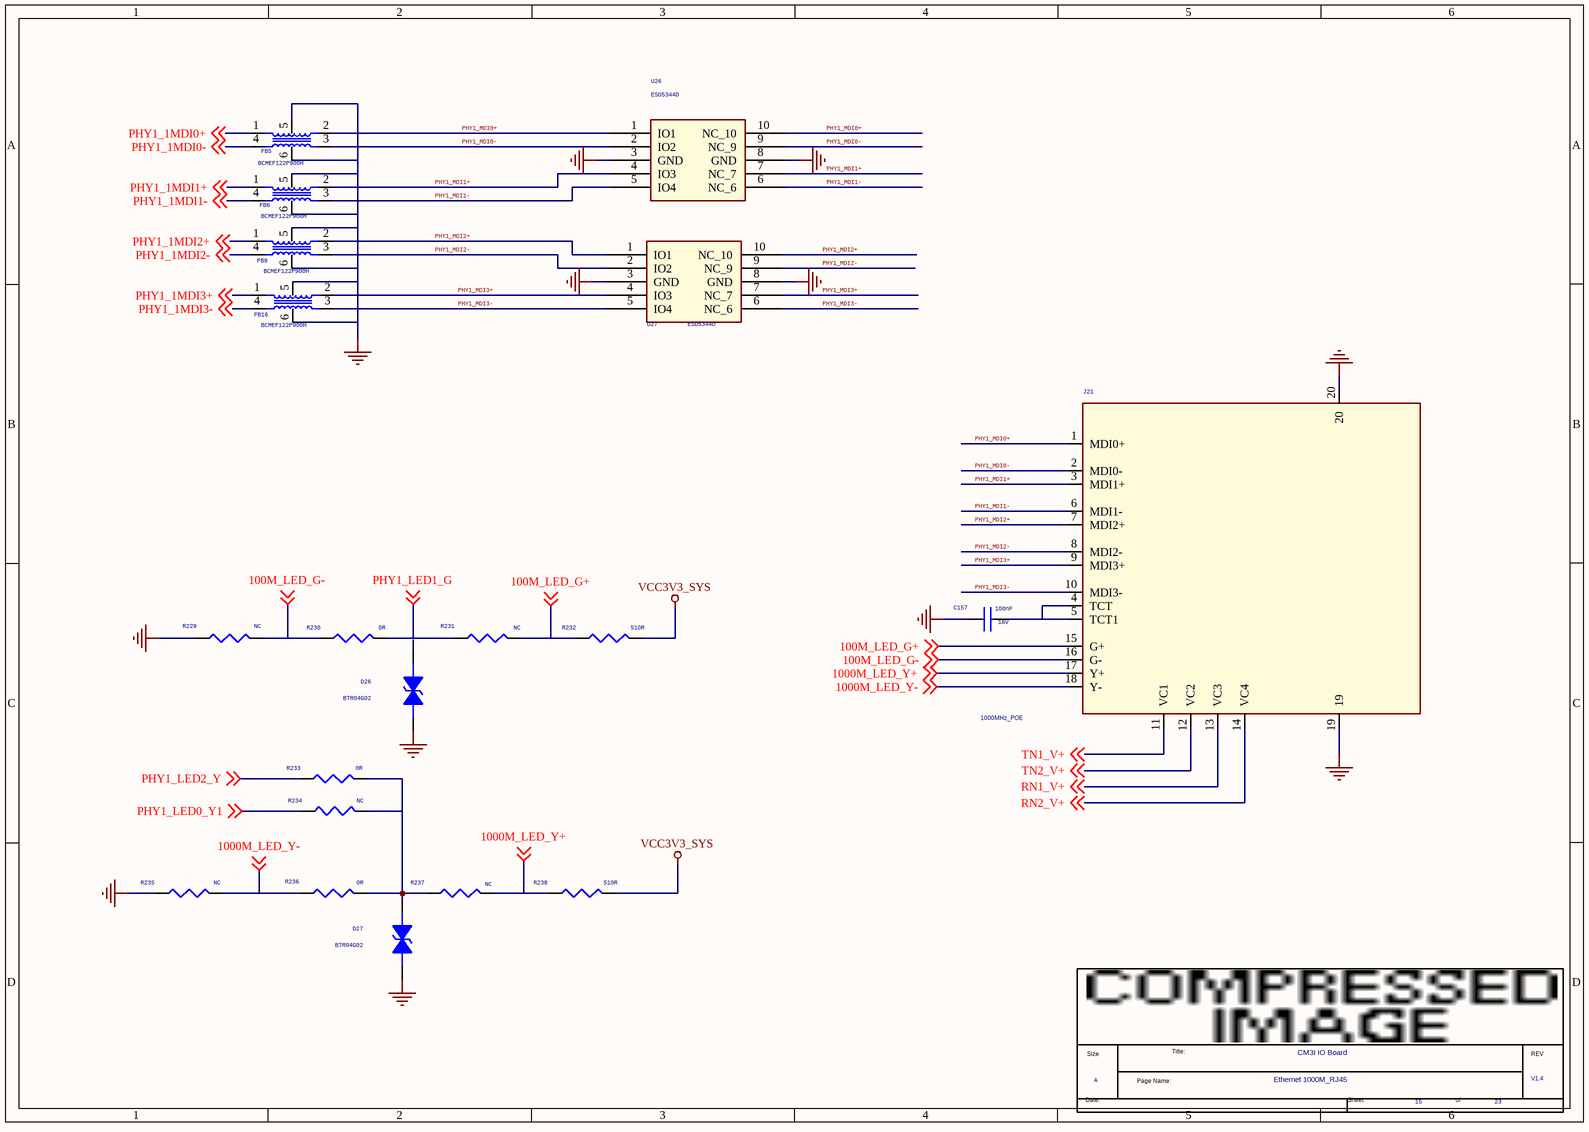
[diagram p13: 15.SchDoc]

### Parts
(Parts that share a designator on the sheet are numbered #1, #2 ... from top to bottom, then left to right.)
*#14  Page Count: 23  Page Number: 15  Page Size: A  Title: CM3I IO Board  RevCode: V1.4  Doc: Ethernet 1000M_RJ45  (hidden comment: radxa_1010)  (graphical)
C157  100nF  Voltage: 16V  [C0402]
D26  BTR04G02  [ESD0402_1xD5]
D27  BTR04G02  [ESD0402_1xD5]
FB5  BCMEF122P900H  [GMDG-6PIN_ESD]
FB6  BCMEF122P900H  [GMDG-6PIN_ESD]
FB9  BCMEF122P900H  [GMDG-6PIN_ESD]
FB16  BCMEF122P900H  [GMDG-6PIN_ESD]
J21  1000MHz_POE  [RJ45_PULSE]
R229  NC  [R0402]
R230  0R  [R0402]
R231  NC  [R0402]
R232  510R  [R0402]
R233  0R  [R0402]
R234  NC  [R0402]
R235  NC  [R0402]
R236  0R  [R0402]
R237  NC  [R0402]
R238  510R  [R0402]
U26  ESD5344D  [SON10_2R50X1R00X0R50]
U27  ESD5344D  [SON10_2R50X1R00X0R50]

### Nets
GND: C157.1 D26.1 D27.1 FB5.5 FB5.6 FB6.5 FB6.6 FB9.5 FB9.6 FB16.5 FB16.6 J21.19 J21.20 R229.1 R235.1 U26.3(GND) U26.8(GND) U27.3(GND) U27.8(GND)
VCC3V3_SYS: R232.2 R238.2
100M_LED_G+: J21.15(G+) R231.2 R232.1 ; off-sheet 100M_LED_G+
100M_LED_G-: J21.16(G-) R229.2 R230.1 ; off-sheet 100M_LED_G-
1000M_LED_Y+: J21.17(Y+) R237.2 R238.1 ; off-sheet 1000M_LED_Y+
1000M_LED_Y-: J21.18(Y-) R235.2 R236.1 ; off-sheet 1000M_LED_Y-
PHY1_1MDI0+: FB5.1(R1) ; off-sheet PHY1_1MDI0+
PHY1_1MDI0-: FB5.4(R2) ; off-sheet PHY1_1MDI0-
PHY1_1MDI1+: FB6.1(R1) ; off-sheet PHY1_1MDI1+
PHY1_1MDI1-: FB6.4(R2) ; off-sheet PHY1_1MDI1-
PHY1_1MDI2+: FB9.1(R1) ; off-sheet PHY1_1MDI2+
PHY1_1MDI2-: FB9.4(R2) ; off-sheet PHY1_1MDI2-
PHY1_1MDI3+: FB16.1(R1) ; off-sheet PHY1_1MDI3+
PHY1_1MDI3-: FB16.4(R2) ; off-sheet PHY1_1MDI3-
PHY1_LED0_Y1: R234.1 ; off-sheet PHY1_LED0_Y1
PHY1_LED1_G: R230.2 R231.1 ; off-sheet PHY1_LED1_G
PHY1_LED2_Y: R233.1 ; off-sheet PHY1_LED2_Y
PHY1_MDI0+: FB5.2(R4) J21.1(MDI0+) U26.1(IO1) U26.10(NC_10)
PHY1_MDI0-: FB5.3(R3) J21.2(MDI0-) U26.2(IO2) U26.9(NC_9)
PHY1_MDI1+: FB6.2(R4) J21.3(MDI1+) U26.4(IO3) U26.7(NC_7)
PHY1_MDI1-: FB6.3(R3) J21.6(MDI1-) U26.5(IO4) U26.6(NC_6)
PHY1_MDI2+: FB9.2(R4) J21.7(MDI2+) U27.1(IO1) U27.10(NC_10)
PHY1_MDI2-: FB9.3(R3) J21.8(MDI2-) U27.2(IO2) U27.9(NC_9)
PHY1_MDI3+: FB16.2(R4) J21.9(MDI3+) U27.4(IO3) U27.7(NC_7)
PHY1_MDI3-: FB16.3(R3) J21.10(MDI3-) U27.5(IO4) U27.6(NC_6)
RN1_V+: J21.13(VC3) ; off-sheet RN1_V+
RN2_V+: J21.14(VC4) ; off-sheet RN2_V+
TN1_V+: J21.11(VC1) ; off-sheet TN1_V+
TN2_V+: J21.12(VC2) ; off-sheet TN2_V+
NetC157_2: C157.2 J21.4(TCT) J21.5(TCT1)
NetD27_2: D27.2 R233.2 R234.2 R236.2 R237.1

Not connected (* = marked no-connect by the designer): D26 2

### Notes on the sheet
- (in symbol radxa_1010) Title:; Size; REV; Page Name:; Date:; Sheet; of

### Library data of the parts
C157 = CAP NP_0: as C203 on sheet 11; Dielectric: X5R; Part Type: C0402; Manufacturer PN: C1005X5R1C104K050BA; Created by: JJJ
D26 D27 = DIODE BI_DIR TRIG_0: as D33 on sheet 11; Part Type: ESD_TVS; Manufacturer PN: ESD5451N; Created by: JJJ
FB5 FB6 FB9 FB16 = R-PACK4_0_Dup1
J21 = HR911130C_1: 千兆网口接口，内置变压器; VAL: J00-0061; DESIG: 10/100 base TX LXT971A; BOI: RJ45; FAB: PULSE; DEV: CON_PULSE_J00-61; Priority: A; REF: J00-0061; Created by: JJJ; Manufacturer Part Number: HR911130C; Part Type: Ethernet Jack; RK PN: HR911130C
R229 R233 R234 = RESISTOR_0_Dup1: as R338 on sheet 11; Created by: YTL; Part Type: 通用厚膜电阻; RK PN: RC0402JR-070RL
R230 R235 R236 = RESISTOR_0_Dup1: as R200 on sheet 14; Part Type: 通用厚膜电阻; Manufacturer PN: RC0402JR-070RL; Created by: YTL
R231 R237 = RESISTOR_0_Dup1: 通用厚膜电阻,0R,+/-5%,R0402,1/16W.; Manufacturer PN: RC0402JR-070RL; Manufacturer: YAGEO; Tolerance: 5%; option: DNP; Wattage: 1/16W; Priority: A; Created by: YTL; Part Type: 通用厚膜电阻; RK PN: RC0402JR-070RL
R232 = RESISTOR_0_Dup1: 通用厚膜电阻,510R,+/-5%,R0402,1/16W.; Manufacturer PN: RC0402JR-07510RL; Manufacturer: YAGEO; Tolerance: 5%; Wattage: 1/16W; Priority: A; Created by: YTL; Part Type: 通用厚膜电阻; RK PN: RC0402JR-07510RL
R238 = RESISTOR_0_Dup1: 通用厚膜电阻,510R,+/-5%,R0402,1/16W.; Manufacturer: YAGEO; Tolerance: 5%; RK PN: RC0402JR-07510RL; Priority: A; Wattage: 1/16W; Part Type: 通用厚膜电阻; Manufacturer PN: RC0402JR-07510RL; Created by: YTL
U26 U27 = ESD_ESD5304D: as U21 on sheet 13; RK PN: ESD5304D; Part Type: ESD_TVS; Manufacturer PN: ESD5304D; Created by: JJJ
*#14 = radxa_1010: Page Create Date: March  8, 1995